# EAGLE board Index Registers - 1.1 (EAGLE 9.6.2), part 1 of 2
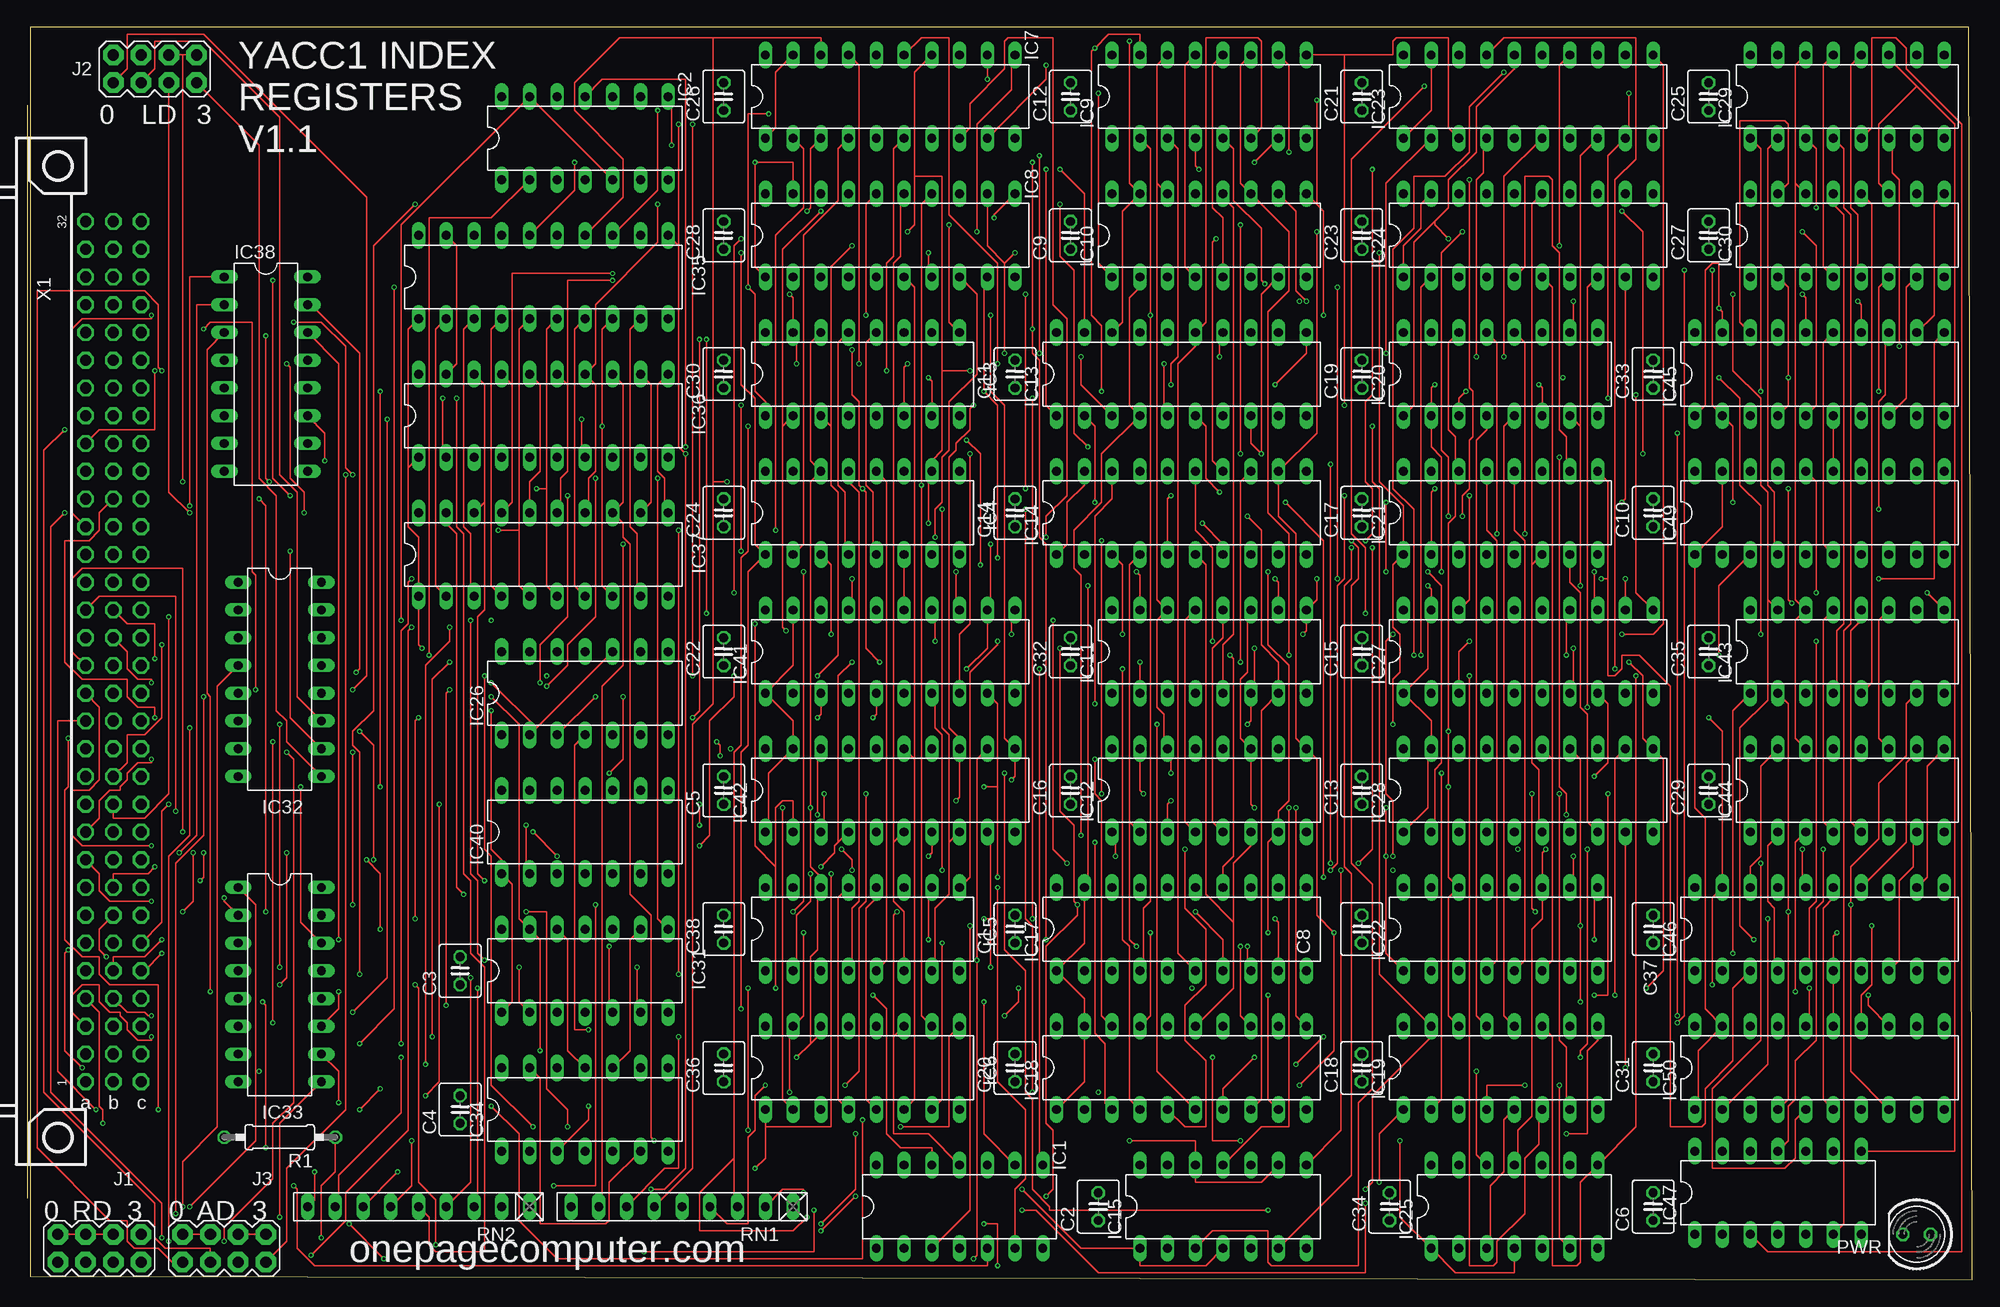
[diagram p8: board, top side]
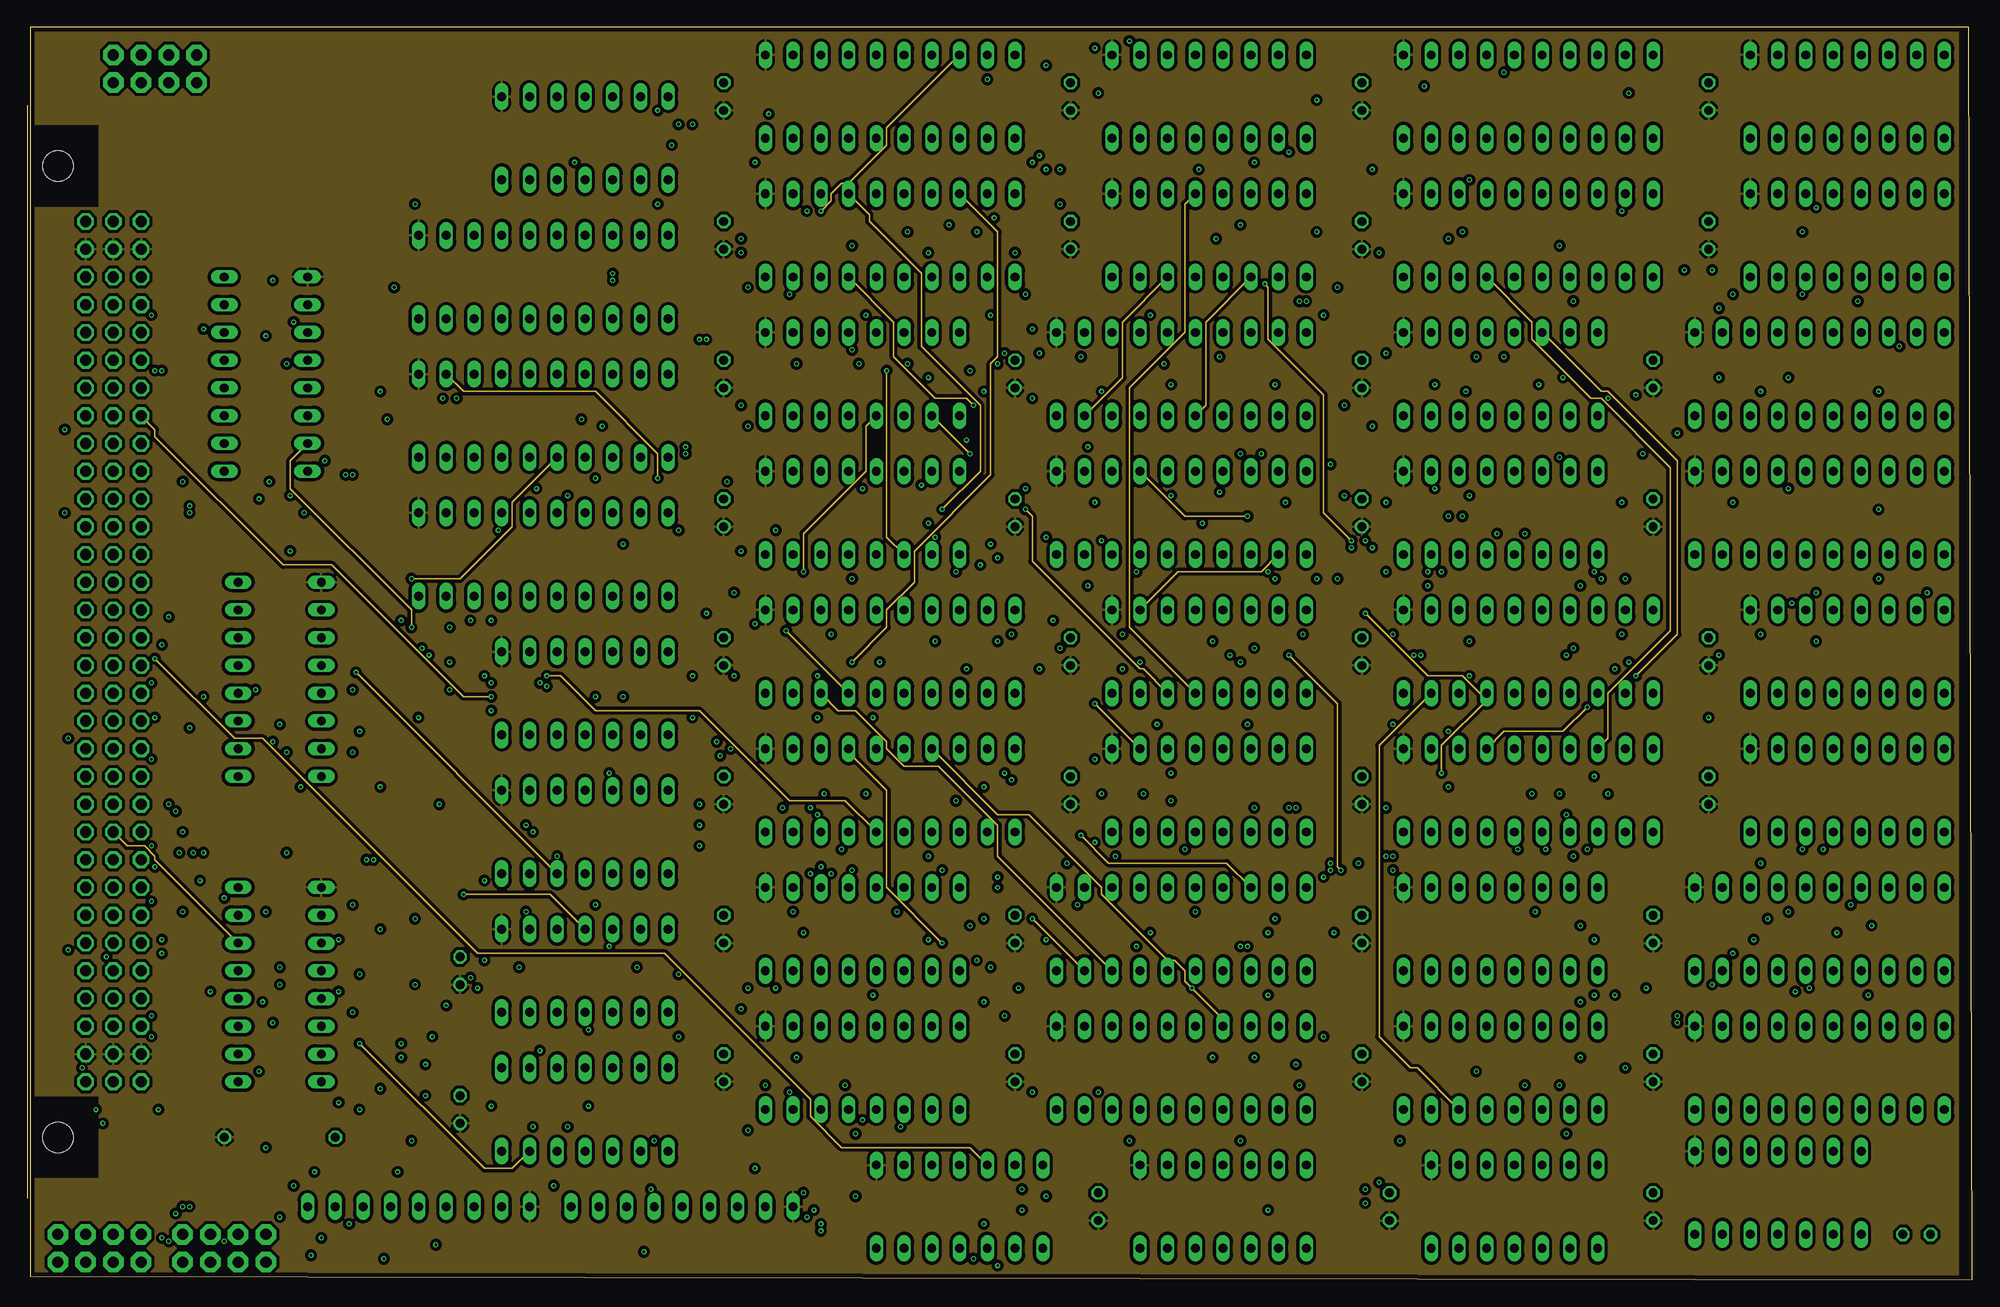
[diagram p9: board, inner layer Route2]
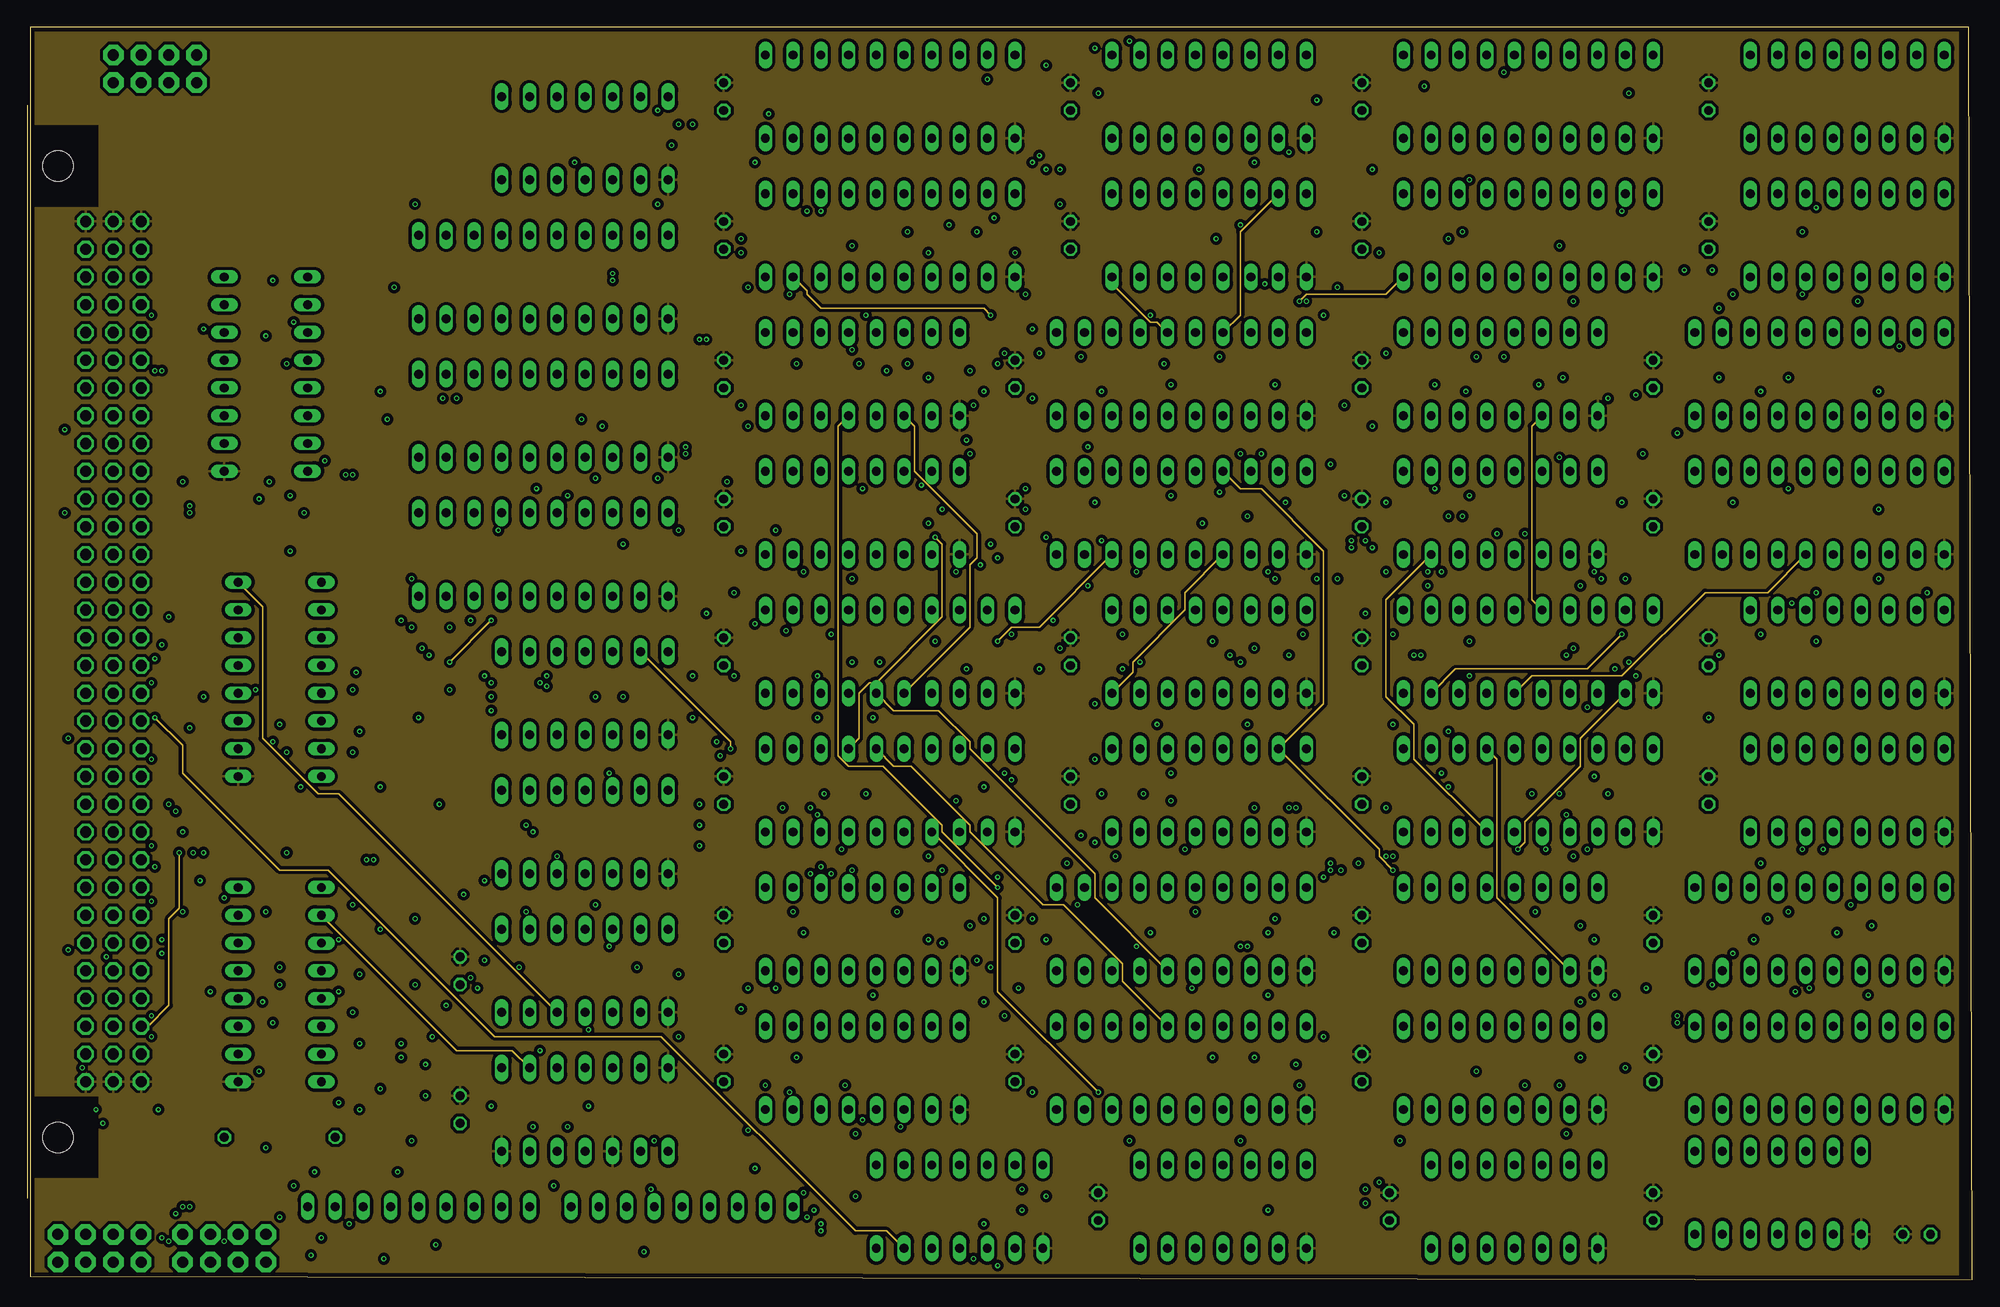
[diagram p10: board, inner layer Route15]
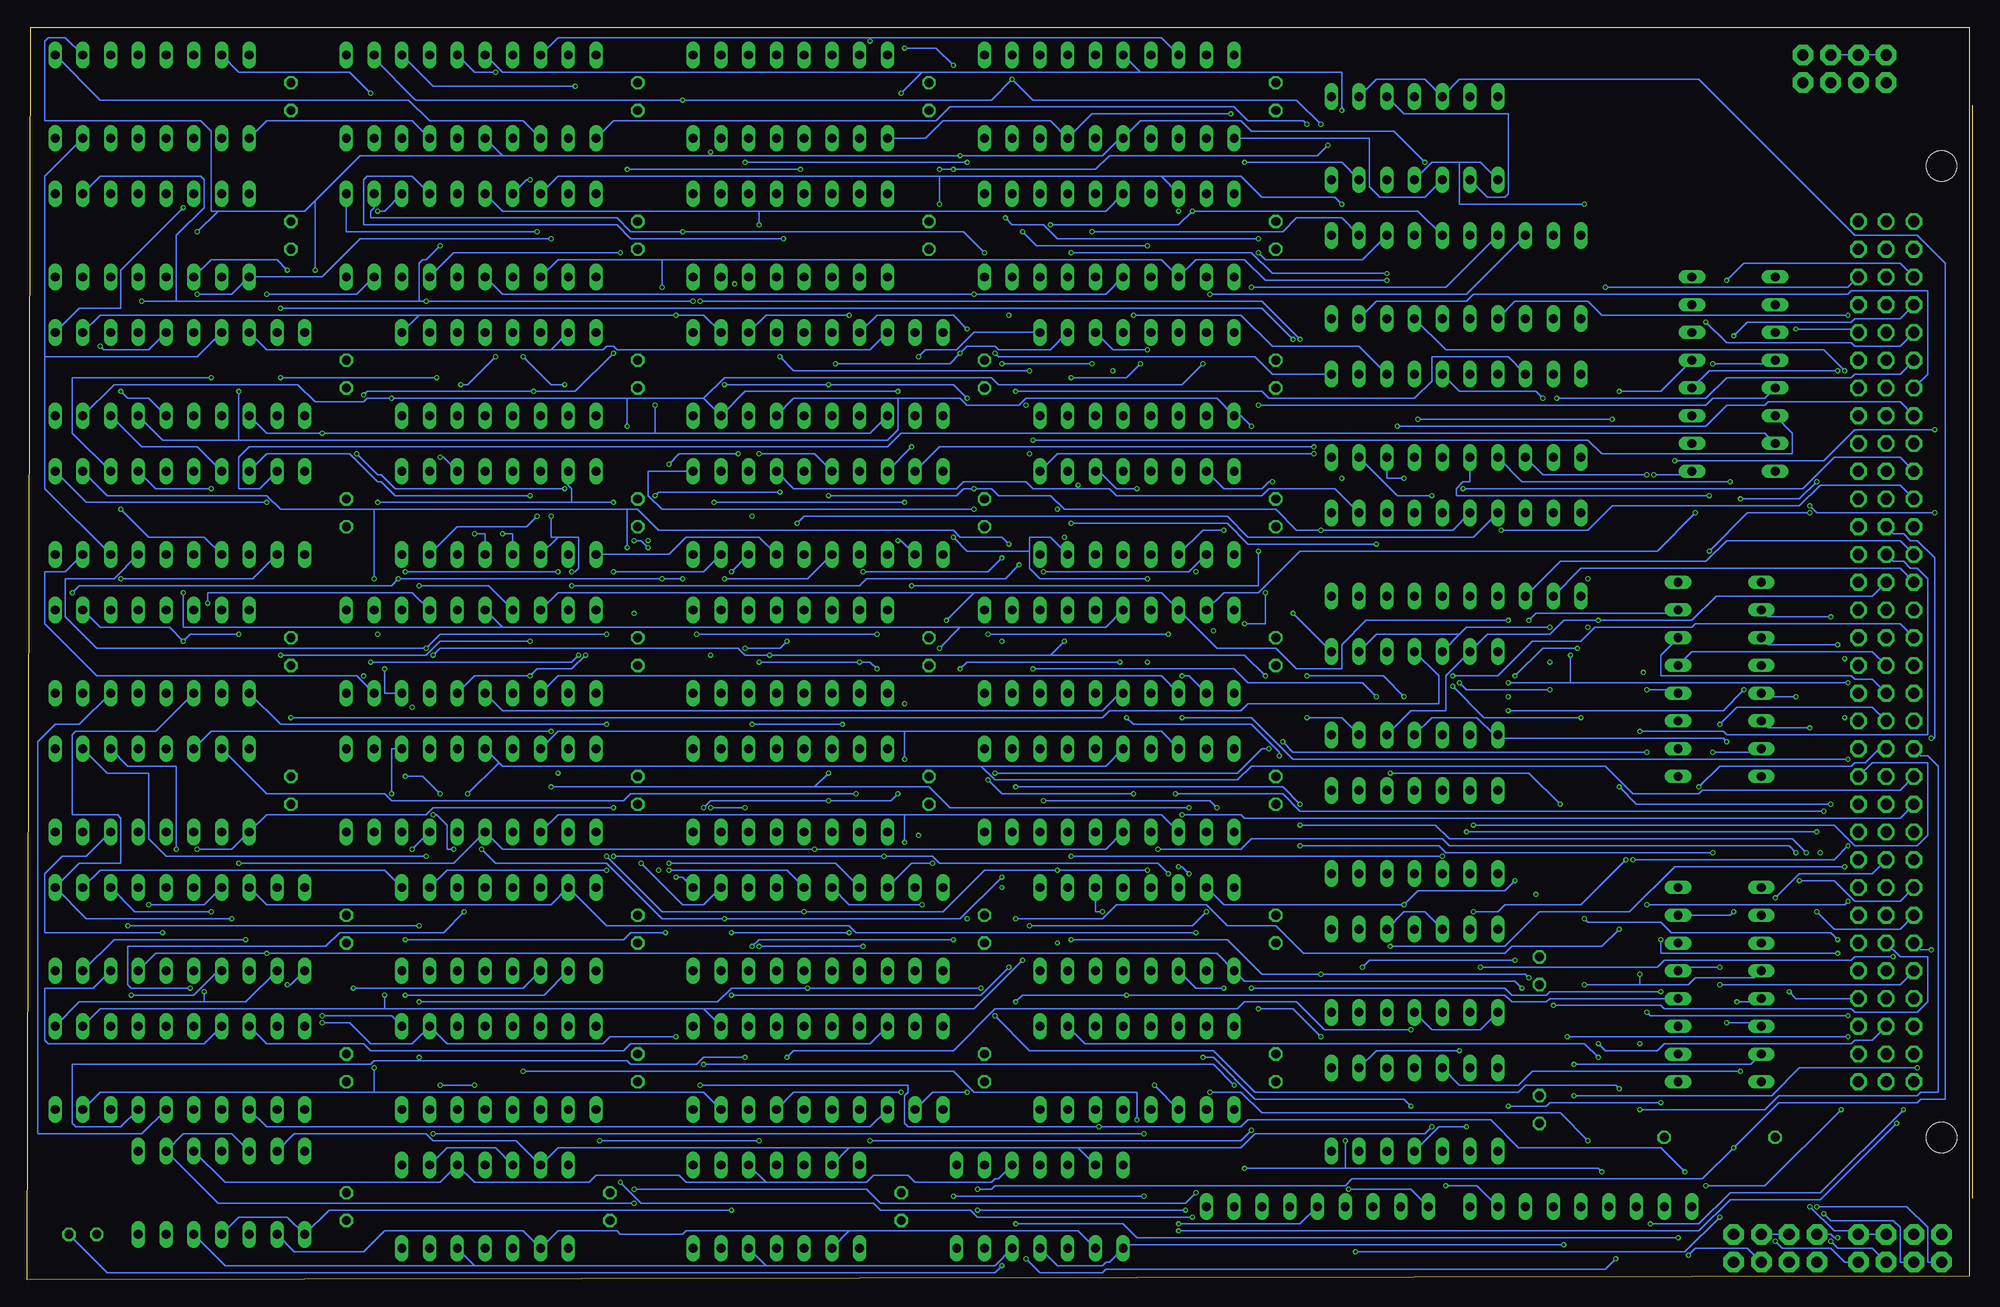
[diagram p11: board, bottom side, seen from below]

Size 177.8 x 114.62 mm. Coordinates in mm from the lower left corner, seen from the top.
Outline: 0,0.33 177.8,0 177.47,114.62 0,114.62 0,0.33
Copper layers (1*2*15*16): Top 0.035559375mm / dielectric 0.17018125mm / Route2 0.01778125mm / dielectric 47mil / Route15 0.01778125mm / dielectric 0.17018125mm / Bottom 0.035559375mm
Design rules "oshpark-4layer *": minimum track width 5mil, minimum drill 10mil, track to track 12mil, track to pad 10mil, pad to pad 5mil, via to via 5mil, smd to smd 5mil, copper to edge 15mil, drill to drill 6mil, minimum pad ring 4mil, minimum via ring 4mil, stop-mask expansion 2.5mil, vias tented up to drill 0mil, thermal gap 10mil

## Footprints (pad centres in the part's own frame; a part is rotated, then mirrored left to right if it is on the bottom)
C025-040X050 = drill 0.813 octagon: 1 -1.27,0; 2 1.27,0
DIL14 = drill 0.813 long: 1 -7.62,-3.81; 2 -5.08,-3.81; 3 -2.54,-3.81; 4 0,-3.81; 5 2.54,-3.81; 6 5.08,-3.81; 7 7.62,-3.81; 8 7.62,3.81; 9 5.08,3.81; 10 2.54,3.81; 11 0,3.81; 12 -2.54,3.81; 13 -5.08,3.81; 14 -7.62,3.81
DIL16 = drill 0.813 long: 1 -8.89,-3.81; 2 -6.35,-3.81; 3 -3.81,-3.81; 4 -1.27,-3.81; 5 1.27,-3.81; 6 3.81,-3.81; 7 6.35,-3.81; 8 8.89,-3.81; 9 8.89,3.81; 10 6.35,3.81; 11 3.81,3.81; 12 1.27,3.81; 13 -1.27,3.81; 14 -3.81,3.81; 15 -6.35,3.81; 16 -8.89,3.81
DIL20 = drill 0.813 long: 1 -11.43,-3.81; 2 -8.89,-3.81; 3 -6.35,-3.81; 4 -3.81,-3.81; 5 -1.27,-3.81; 6 1.27,-3.81; 7 3.81,-3.81; 8 6.35,-3.81; 9 8.89,-3.81; 10 11.43,-3.81; 11 11.43,3.81; 12 8.89,3.81; 13 6.35,3.81; 14 3.81,3.81; 15 1.27,3.81; 16 -1.27,3.81; 17 -3.81,3.81; 18 -6.35,3.81; 19 -8.89,3.81; 20 -11.43,3.81
2X4 = drill 1.016 pad 1.88 octagon: 1 -3.81,-1.27; 2 -3.81,1.27; 3 -1.27,-1.27; 4 -1.27,1.27; 5 1.27,-1.27; 6 1.27,1.27; 7 3.81,-1.27; 8 3.81,1.27
LED5MM = drill 0.813 octagon: A -1.27,0; K 1.27,0
0207/10 = drill 0.813 octagon: 1 -5.08,0; 2 5.08,0
RN-9 = drill 0.813 long: 1 -10.16,0; 2 -7.62,0; 3 -5.08,0; 4 -2.54,0; 5 0,0; 6 2.54,0; 7 5.08,0; 8 7.62,0; 9 10.16,0
FABC96R = drill 1.016 octagon: A1 -2.54,39.37; A2 -2.54,36.83; A3 -2.54,34.29; A4 -2.54,31.75; A5 -2.54,29.21; A6 -2.54,26.67; A7 -2.54,24.13; A8 -2.54,21.59; A9 -2.54,19.05; A10 -2.54,16.51; A11 -2.54,13.97; A12 -2.54,11.43; A13 -2.54,8.89; A14 -2.54,6.35; A15 -2.54,3.81; A16 -2.54,1.27; A17 -2.54,-1.27; A18 -2.54,-3.81; A19 -2.54,-6.35; A20 -2.54,-8.89; A21 -2.54,-11.43; A22 -2.54,-13.97; A23 -2.54,-16.51; A24 -2.54,-19.05; A25 -2.54,-21.59; A26 -2.54,-24.13; A27 -2.54,-26.67; A28 -2.54,-29.21; A29 -2.54,-31.75; A30 -2.54,-34.29; A31 -2.54,-36.83; A32 -2.54,-39.37; B1 -5.08,39.37; B2 -5.08,36.83; B3 -5.08,34.29; B4 -5.08,31.75; B5 -5.08,29.21; B6 -5.08,26.67; B7 -5.08,24.13; B8 -5.08,21.59; B9 -5.08,19.05; B10 -5.08,16.51; B11 -5.08,13.97; B12 -5.08,11.43; B13 -5.08,8.89; B14 -5.08,6.35; B15 -5.08,3.81; B16 -5.08,1.27; B17 -5.08,-1.27; B18 -5.08,-3.81; B19 -5.08,-6.35; B20 -5.08,-8.89; B21 -5.08,-11.43; B22 -5.08,-13.97; B23 -5.08,-16.51; B24 -5.08,-19.05; B25 -5.08,-21.59; B26 -5.08,-24.13; B27 -5.08,-26.67; B28 -5.08,-29.21; B29 -5.08,-31.75; B30 -5.08,-34.29; B31 -5.08,-36.83; B32 -5.08,-39.37; C1 -7.62,39.37; C2 -7.62,36.83; C3 -7.62,34.29; C4 -7.62,31.75; C5 -7.62,29.21; C6 -7.62,26.67; C7 -7.62,24.13; C8 -7.62,21.59; C9 -7.62,19.05; C10 -7.62,16.51; C11 -7.62,13.97; C12 -7.62,11.43; C13 -7.62,8.89; C14 -7.62,6.35; C15 -7.62,3.81; C16 -7.62,1.27; C17 -7.62,-1.27; C18 -7.62,-3.81; C19 -7.62,-6.35; C20 -7.62,-8.89; C21 -7.62,-11.43; C22 -7.62,-13.97; C23 -7.62,-16.51; C24 -7.62,-19.05; C25 -7.62,-21.59; C26 -7.62,-24.13; C27 -7.62,-26.67; C28 -7.62,-29.21; C29 -7.62,-31.75; C30 -7.62,-34.29; C31 -7.62,-36.83; C32 -7.62,-39.37 | hole 2.794: 0,-44.456; 0,44.456

## Placement (x,y rotation side)
C1  0.1  [C025-040X050]  90.17,32.08 90 top
C2  0.1  [C025-040X050]  97.79,6.68 90 top
C3  0.1  [C025-040X050]  39.37,28.27 90 top
C4  0.1  [C025-040X050]  39.37,15.57 90 top
C5  0.1  [C025-040X050]  63.5,44.78 90 top
C6  0.1  [C025-040X050]  148.59,6.68 90 top
C8  0.1  [C025-040X050]  121.92,32.08 90 top
C9  0.1  [C025-040X050]  95.25,95.58 90 top
C10  0.1  [C025-040X050]  148.59,70.18 90 top
C11  0.1  [C025-040X050]  90.17,82.88 90 top
C12  0.1  [C025-040X050]  95.25,108.28 90 top
C13  0.1  [C025-040X050]  121.92,44.78 90 top
C14  0.1  [C025-040X050]  90.17,70.18 90 top
C15  0.1  [C025-040X050]  121.92,57.48 90 top
C16  0.1  [C025-040X050]  95.25,44.78 90 top
C17  0.1  [C025-040X050]  121.92,70.18 90 top
C18  0.1  [C025-040X050]  121.92,19.38 90 top
C19  0.1  [C025-040X050]  121.92,82.88 90 top
C20  0.1  [C025-040X050]  90.17,19.38 90 top
C21  0.1  [C025-040X050]  121.92,108.28 90 top
C22  0.1  [C025-040X050]  63.5,57.48 90 top
C23  0.1  [C025-040X050]  121.92,95.58 90 top
C24  0.1  [C025-040X050]  63.5,70.18 90 top
C25  0.1  [C025-040X050]  153.67,108.28 90 top
C26  0.1  [C025-040X050]  63.5,108.28 90 top
C27  0.1  [C025-040X050]  153.67,95.58 90 top
C28  0.1  [C025-040X050]  63.5,95.58 90 top
C29  0.1  [C025-040X050]  153.67,44.78 90 top
C30  0.1  [C025-040X050]  63.5,82.88 90 top
C31  0.1  [C025-040X050]  148.59,19.38 90 top
C32  0.1  [C025-040X050]  95.25,57.48 90 top
C33  0.1  [C025-040X050]  148.59,82.88 90 top
C34  0.1  [C025-040X050]  124.46,6.68 90 top
C35  0.1  [C025-040X050]  153.67,57.48 90 top
C36  0.1  [C025-040X050]  63.5,19.38 90 top
C37  0.1  [C025-040X050]  148.59,32.08 90 top
C38  0.1  [C025-040X050]  63.5,32.08 90 top
IC1  74LS32N  [DIL14]  85.09,6.68 0 top
IC2  74LS32N  [DIL14]  50.8,104.47 0 top
IC3  74LS192N  [DIL16]  76.2,82.88 0 top
IC4  74LS192N  [DIL16]  76.2,70.18 0 top
IC5  74LS192N  [DIL16]  76.2,32.08 0 top
IC6  74LS192N  [DIL16]  76.2,19.38 0 top
IC7  74LS244N  [DIL20]  78.74,108.28 0 top
IC8  74LS244N  [DIL20]  78.74,95.58 0 top
IC9  74LS192N  [DIL16]  107.95,108.28 0 top
IC10  74LS192N  [DIL16]  107.95,95.58 0 top
IC11  74LS192N  [DIL16]  107.95,57.48 0 top
IC12  74LS192N  [DIL16]  107.95,44.78 0 top
IC13  74LS244N  [DIL20]  105.41,82.88 0 top
IC14  74LS244N  [DIL20]  105.41,70.18 0 top
IC15  74LS32N  [DIL14]  109.22,6.68 0 top
IC17  74LS244N  [DIL20]  105.41,32.08 0 top
IC18  74LS244N  [DIL20]  105.41,19.38 0 top
IC19  74LS192N  [DIL16]  134.62,19.38 0 top
IC20  74LS192N  [DIL16]  134.62,82.88 0 top
IC21  74LS192N  [DIL16]  134.62,70.18 0 top
IC22  74LS192N  [DIL16]  134.62,32.08 0 top
IC23  74LS244N  [DIL20]  137.16,108.28 0 top
IC24  74LS244N  [DIL20]  137.16,95.58 0 top
IC25  74LS32N  [DIL14]  135.89,6.68 0 top
IC26  74LS32N  [DIL14]  50.8,53.67 0 top
IC27  74LS244N  [DIL20]  137.16,57.48 0 top
IC28  74LS244N  [DIL20]  137.16,44.78 0 top
IC29  74LS192N  [DIL16]  166.37,108.28 0 top
IC30  74LS192N  [DIL16]  166.37,95.58 0 top
IC31  74LS32N  [DIL14]  50.8,28.27 0 top
IC32  74LS139N  [DIL16]  22.86,54.94 270 top
IC33  74LS139N  [DIL16]  22.86,27 270 top
IC34  4077N  [DIL14]  50.8,15.57 0 top
IC35  74LS245N  [DIL20]  46.99,91.77 0 top
IC36  74LS245N  [DIL20]  46.99,79.07 0 top
IC37  74LS245N  [DIL20]  46.99,66.37 0 top
IC38  74LS139N  [DIL16]  21.59,82.88 270 top
IC40  74LS32N  [DIL14]  50.8,40.97 0 top
IC41  74LS244N  [DIL20]  78.74,57.48 0 top
IC42  74LS244N  [DIL20]  78.74,44.78 0 top
IC43  74LS192N  [DIL16]  166.37,57.48 0 top
IC44  74LS192N  [DIL16]  166.37,44.78 0 top
IC45  74LS244N  [DIL20]  163.83,82.88 0 top
IC46  74LS244N  [DIL20]  163.83,32.08 0 top
IC47  74LS32N  [DIL14]  160.02,7.95 0 top
IC49  74LS244N  [DIL20]  163.83,70.18 0 top
IC50  74LS244N  [DIL20]  163.83,19.38 0 top
J1  [2X4]  6.35,2.87 0 top
J2  [2X4]  11.43,110.82 0 top
J3  [2X4]  17.78,2.87 0 top
PWR  [LED5MM]  172.72,4.14 180 top
R1  330  [0207/10]  22.86,13.03 180 top
RN1  10k  [RN-9]  59.69,6.68 180 top
RN2  10k  [RN-9]  35.56,6.68 180 top
X1  FABC96R  [FABC96R]  2.54,57.48 180 top

## Tracks (layer width: path | path; a pad name or v marks a point on that pad's centre or on a via)
-ADDRSEL  (via drill 0.25)
  Top 0.127: J3.8 J3.6 | IC38.1 14.61,91.77 v14.61,70.81 | v3.17,70.18 1.91,68.91 1.91,17.16 12.06,7 v12.06,3.82 | J3.2 J3.4
  Bottom 0.127: v14.61,70.81 13.97,70.18 v3.17,70.18 | v12.06,3.82 12.38,3.82 12.7,4.14 J3.2 | J3.4 J3.6
-ARD0  (via drill 0.25)
  Top 0.127: v12.06,83.2 11.75,83.52 11.75,89.23 10.48,90.5 0.64,90.5 0.64,12.08 7.3,5.41 8.89,5.41 8.89,3.5 9.53,2.87 11.75,2.87 13.02,1.6 J3.1
  Bottom 0.127: IC38.12 23.81,83.2 v12.06,83.2
-BUS-EN  (via drill 0.25)
  Top 0.127: IC31.1 44.13,25.41 44.13,36.21 IC40.1 43.18,38.43 42.23,39.38 v42.23,52.08 | v15.88,87.01 16.51,87.64 20.32,87.64 20.32,64.78 20.64,64.47 v20.64,53.99
  Bottom 0.127: IC31.1 44.77,22.87 49.21,22.87 IC31.4 | X1.C28 10.48,87.01 v15.88,87.01 | v20.64,53.99 22.54,52.08 v42.23,52.08
-HL-SWAP  (via drill 0.25)
  Top 0.127: v46.67,20.97 46.67,31.13 IC31.13 44.77,33.03 44.77,50.81 v42.23,53.35
  Route2 0.127: X1.C25 11.43,77.8 11.43,77.16 23.18,65.42 27.62,65.42 39.69,53.35 v42.23,53.35
  Bottom 0.127: IC34.9 54.29,20.97 v46.67,20.97
-LDSEL  (via drill 0.25)
  Top 0.127: J2.8 13.97,112.09 | 13.97,112.09 J2.6 | IC34.6 53.02,8.9 53.02,5.41 52.7,5.09 46.67,5.09 46.67,18.43 IC34.13 | v13.97,73.04 13.97,112.09 | v20.95,71.45 21.59,70.81 v21.59,33.67
  Route15 0.127: IC33.15 39.05,20.97 44.13,20.97 IC34.13
  Bottom 0.127: J2.2 J2.4 J2.6 | v13.97,73.04 15.56,71.45 v20.95,71.45 | v21.59,33.67 21.91,33.35 IC33.15
-R0-ADDRSEL  (via drill 0.25)
  Top 0.127: IC42.1 67.63,41.29 67.63,46.37 IC42.19 69.85,51.13 IC41.1 69.85,56.21 IC41.19 | v23.5,83.83 23.81,83.52 23.81,73.36 25.08,72.08 v25.08,70.18
  Bottom 0.127: IC38.4 18.1,83.83 v23.5,83.83 | v25.08,70.18 28.57,66.69 61.28,66.69 65.09,62.88 68.26,62.88 IC41.19
-R0-LDSEL  (via drill 0.25)
  Top 0.127: v77.15,26.05 78.42,24.78 78.42,13.35 79.69,12.08 82.55,12.08 IC1.12 | IC1.9 87.31,13.35 v87.31,25.41
  Bottom 0.127: IC33.12 38.42,25.73 38.73,25.41 41.91,25.41 42.55,26.05 v77.15,26.05 86.68,26.05 v87.31,25.41
-R0-RDSEL  (via drill 0.25)
  Top 0.127: v35.24,27 35.56,26.68 35.56,8.9 37.15,7.32 v37.15,3.19 | v35.24,98.44 31.43,94.63 31.43,52.08 29.53,50.18 29.53,48.91 30.16,48.27 v30.16,27.95
  Bottom 0.127: IC2.1 44.77,102.25 46.67,102.25 | 46.67,102.25 49.21,102.25 IC2.4 | IC1.4 83.5,1.28 79.38,1.28 79.06,1.6 78.74,1.6 IC1.1 77.15,3.19 v37.15,3.19 | IC33.4 19.68,27.63 25.08,27.63 25.72,27 30.16,27 | v35.24,27 30.16,27 | 46.67,102.25 46.67,98.44 v35.24,98.44 | 30.16,27 v30.16,27.95
-R1-ADDRSEL  (via drill 0.25)
  Top 0.127: IC18.1 96.52,18.11 IC18.19 96.52,25.73 IC17.1 96.52,30.81 IC17.19 96.84,36.21 v96.84,63.51 | v65.09,66.69 v65.09,80.02
  Bottom 0.127: IC38.5 18.73,80.66 23.5,80.66 24.13,80.02 v65.09,80.02 | v65.09,66.69 65.09,63.51 v96.84,63.51
-R1-LDSEL  (via drill 0.25)
  Top 0.127: IC33.11 28.26,24.78 v28.26,26.36 | v65.72,13.67 v65.72,26.68 | v100.65,12.71 106.68,12.71 IC15.12 106.68,8.9 112.71,8.9 IC15.9
  Bottom 0.127: v28.26,26.36 38.42,26.36 38.73,26.05 41.91,26.05 42.55,26.68 v65.72,26.68 | v65.72,13.67 66.67,12.71 v100.65,12.71
-R1-RDSEL  (via drill 0.25)
  Top 0.127: v21.27,25.41 21.59,25.09 v21.59,12.08 | v90.81,8.27 96.2,2.87 IC15.1 101.6,1.28 107.63,1.28 IC15.4
  Bottom 0.127: IC2.9 54.29,109.87 49.85,109.87 IC2.12 46.67,109.87 24.77,109.87 10.48,95.58 4.76,95.58 2.22,93.04 2.22,16.52 4.45,16.52 4.76,16.2 17.46,16.2 v21.59,12.08 24.45,9.22 56.52,9.22 57.15,8.59 89.22,8.59 89.53,8.27 v90.81,8.27 | IC33.5 19.37,25.41 v21.27,25.41
-R2-ADDRSEL  (via drill 0.25)
  Top 0.127: IC28.1 127.95,43.19 127.95,48.27 IC28.19 128.27,51.13 IC27.1 127.95,55.89 127.95,60.97 IC27.19 128.27,63.2 v127.95,63.51 | v85.72,76.85 87,75.58 v87,65.42
  Bottom 0.127: IC38.6 16.19,77.48 16.19,75.58 33.66,75.58 34.92,76.85 v85.72,76.85 | v87,65.42 88.27,64.15 100.97,64.15 101.6,63.51 v127.95,63.51
-R2-LDSEL  (via drill 0.25)
  Top 0.127: IC33.10 28.26,19.06 v28.26,16.2 | v42.23,15.89 44.77,13.35 44.77,5.41 48.26,1.92 76.2,1.92 v76.2,14.62 | v132.4,19.06 132.4,11.44 IC25.12
  Bottom 0.127: IC25.12 134.94,12.08 139.38,12.08 IC25.9 | v28.26,16.2 38.42,16.2 38.73,15.89 v42.23,15.89 | v76.2,14.62 76.2,17.16 91.12,17.16 93.03,19.06 v132.4,19.06
-R2-RDSEL  (via drill 0.25)
  Top 0.127: IC25.4 135.89,0.65 130.49,0.65 IC25.1 125.41,5.73 v125.41,12.71 | v22.23,49.23 v22.23,23.51 | v110.81,12.71 108.27,12.71 v108.27,20.33 | v51.12,22.87 49.85,22.87 49.85,48.91 IC26.4
  Bottom 0.127: IC33.6 19.37,23.51 v22.23,23.51 | v22.23,49.23 22.54,49.54 42.86,49.54 IC26.1 43.5,49.86 45.09,51.45 49.21,51.45 IC26.4 | v110.81,12.71 v125.41,12.71 | v108.27,20.33 107.63,20.97 93.03,20.97 89.22,24.78 66.99,24.78 66.36,25.41 61.59,25.41 59.05,22.87 v51.12,22.87
-R3-ADDRSEL
  Top 0.127: IC50.1 152.72,15.89 152.72,20.97 IC50.19 153.35,24.78 153.35,42.24 152.4,43.19 IC49.1 154.94,68.91 IC49.19
  Bottom 0.127: IC38.7 18.73,77.48 97.79,77.48 99.06,76.21 157.48,76.21 158.43,75.26 158.43,72.4 156.53,72.4 IC49.19
-R3-LDSEL  (via drill 0.25)
  Top 0.127: IC33.9 22.86,14.3 v22.86,5.73 | v56.2,2.55 71.75,2.55 v71.75,6.36 | v90.81,6.36 92.08,6.36 97.79,0.65 122.24,0.65 v122.24,7
  Bottom 0.127: IC47.12 159.07,13.35 163.51,13.35 IC47.9 160.34,7 v122.24,7 | v22.86,5.73 26.04,2.55 v56.2,2.55 | v90.81,6.36 v71.75,6.36
-R3-RDSEL  (via drill 0.25)
  Top 0.127: v36.2,19.7 36.2,56.21 38.42,58.43 v38.42,59.7 | v113.35,6.36 93.34,6.36 93.34,6.68 91.76,8.27 91.76,16.52 91.12,17.16 91.12,28.27 89.22,30.17 v89.22,46.37
  Route15 0.127: v64.14,48.59 64.14,49.23 IC26.9
  Bottom 0.127: IC47.4 158.43,5.73 153.99,5.73 IC47.1 150.18,6.36 v113.35,6.36 | IC33.7 20,19.7 v36.2,19.7 | v38.42,59.7 46.04,59.7 46.67,59.07 | IC26.12 46.67,59.07 | IC26.9 54.29,59.07 46.67,59.07 | v89.22,46.37 66.99,46.37 64.77,48.59 v64.14,48.59
-RDSEL  (via drill 0.25)
  Top 0.127: J1.2 J1.4 J1.6 | IC33.1 20.64,34.3 20.64,19.06 | 20.64,19.06 20.64,12.71 v14.61,6.68 | 20.64,19.06 v20.95,19.06
  Bottom 0.127: v14.61,6.68 12.38,4.46 10.48,4.46 J1.8 J1.6 | IC34.12 46.67,17.79 41.27,17.79 40.01,19.06 v20.95,19.06
-REG-DN  (via drill 0.25)
  Top 0.127: v3.49,49.54 3.49,45.1 3.17,44.78 3.17,31.13 4.76,29.54 6.35,29.54 6.35,27.95 7.3,27 11.75,27 v11.75,15.57 | v24.13,8.59 24.45,8.27 24.45,2.87 26.04,1.28 87.63,1.28 IC1.5
  Bottom 0.127: IC1.5 89.22,1.28 110.17,1.28 | IC15.5 110.17,1.28 | 136.84,1.28 IC25.5 | 110.17,1.28 136.84,1.28 | IC47.5 159.7,1.28 136.84,1.28 | X1.B21 6.99,68.27 6.03,68.27 5.4,67.64 4.76,67.64 3.17,66.05 3.17,49.54 v3.49,49.54 | v11.75,15.57 18.73,8.59 v24.13,8.59
-REG-FUNC-LD  (via drill 0.25)
  Top 0.127: IC31.5 53.02,24.78 v53.02,30.49 | v11.43,37.8 10.79,37.16 7.62,37.16 X1.B8
  Bottom 0.127: v53.02,30.49 42.55,30.49 39.37,33.67 31.11,33.67 26.99,37.8 v11.43,37.8
-REG-FUNC-RD  (via drill 0.25)
  Top 0.127: IC31.2 44.77,25.41 v44.77,28.59 | v6.99,29.54 6.35,30.17 6.35,32.08 X1.B7
  Bottom 0.127: v44.77,28.59 28.57,28.59 27.94,29.22 10.79,29.22 10.48,29.54 v6.99,29.54
-REG-LD-HI  (via drill 0.25)
  Top 0.127: v30.16,50.18 31.43,48.91 v31.43,38.43 | v45.4,33.67 47.31,33.67 47.31,17.47 49.21,15.57 v49.21,13.98
  Bottom 0.127: 81.6,12.08 IC1.13 | 102.55,12.08 81.6,12.08 | IC15.13 102.55,12.08 | 102.55,12.08 129.22,12.08 IC25.13 133.03,12.71 140.65,12.71 141.29,13.35 153.35,13.35 IC47.13 | X1.B20 6.99,65.73 6.03,65.73 5.4,65.1 4.76,65.1 3.81,64.15 3.81,49.86 22.23,49.86 22.54,50.18 v30.16,50.18 | v31.43,38.43 35.56,34.3 42.55,34.3 43.18,33.67 v45.4,33.67 | v49.21,13.98 49.85,13.35 65.41,13.35 66.67,12.08 81.6,12.08
-REG-LD-LO  (via drill 0.25)
  Top 0.127: X1.B18 8.89,60.02 11.43,60.02 v11.43,56.84
  Route2 0.127: v11.43,56.84 18.73,49.54 21.27,49.54 40.96,29.86 58.1,29.86 71.44,16.52 71.44,14.94 74.3,12.08 86.04,12.08 IC1.10
  Bottom 0.127: IC47.10 159.7,8.9 140.02,8.9 IC25.10 136.84,8.9 126.36,8.9 125.73,9.54 118.11,9.54 117.47,8.9 110.17,8.9 | IC1.10 88.9,9.22 89.22,9.22 89.53,8.9 96.52,8.9 97.16,9.54 100.33,9.54 100.97,8.9 110.17,8.9 | IC15.10 110.17,8.9
-REG-RD-HI  (via drill 0.25)
  Top 0.127: IC2.5 IC2.13 33.97,96.53 v33.97,60.34
  Bottom 0.127: IC26.5 51.12,52.08 47.94,52.08 47.94,55.26 IC26.13 44.13,59.07 38.42,59.07 37.15,60.34 v33.97,60.34 25.4,60.34 23.18,62.56 8.89,62.56 X1.B19
-REG-RD-LO  (via drill 0.25)
  Top 0.127: IC26.10 46.35,50.49 | 46.35,50.49 IC26.2 | X1.B17 8.89,57.48 8.89,55.89 9.84,54.94 11.11,54.94 v11.11,54.62 | 46.35,50.49 v42.23,54.62 | IC2.2 42.23,97.17 36.51,97.17 v36.51,57.16
  Bottom 0.127: IC2.2 44.13,99.07 42.55,99.07 42.23,99.39 42.23,106.69 51.75,106.69 IC2.10 | v42.23,54.62 36.51,54.62 | 36.51,54.62 v11.11,54.62 | 36.51,54.62 v36.51,57.16
-REG-UP  (via drill 0.25)
  Top 0.127: X1.B22 6.35,70.18 6.35,68.59 5.4,67.64 3.17,67.64 3.17,56.53 4.76,54.94 8.89,54.94 8.89,53.35 9.84,52.4 11.43,52.4 v11.43,51.45
  Route15 0.127: v11.43,51.45 13.97,48.91 13.97,46.37 22.86,37.48 27.3,37.48 42.55,22.24 57.78,22.24 75.56,4.46 78.42,4.46 IC1.2
  Bottom 0.127: IC47.2 153.35,2.55 147,2.55 145.1,4.46 132.4,4.46 IC25.2 129.22,4.46 123.83,4.46 123.51,4.14 117.79,4.14 117.47,4.46 102.55,4.46 | IC1.2 81.6,4.46 102.55,4.46 | IC15.2 102.55,4.46
-RESET  (via drill 0.25)
  Top 0.127: v30.16,21.6 33.34,24.78 v33.34,90.82
  Route2 0.127: IC34.2 44.13,10.17 41.59,10.17 v30.16,21.6
  Bottom 0.127: v33.34,90.82 11.11,90.82 X1.C30
-RLD0  (via drill 0.25)
  Top 0.127: v29.53,53.99 30.8,55.26 30.8,99.07 15.88,114 8.89,114 8.89,110.82 J2.1
  Bottom 0.127: IC32.12 26.99,53.99 v29.53,53.99
-RRD0  (via drill 0.25)
  Top 0.127: IC32.4 17.14,54.3 17.14,13.98 13.97,10.81 v13.97,6.68
  Bottom 0.127: v13.97,6.68 5.71,6.68 3.81,4.78 3.81,1.6 J1.1
-VMA  (via drill 0.25)
  Top 0.127: IC40.2 45.4,37.48 v45.4,41.6
  Bottom 0.127: v45.4,41.6 12.38,41.6 10.48,39.7 4.76,39.7 3.81,40.65 3.81,47.32 8.89,47.32 X1.C12
ADATA0  (via drill 0.25)
  Top 0.127: RN1.2 68.9,8.27 70.8,8.27 v70.8,7.95 | v122.24,8.27 122.87,8.9 122.87,16.84 128.27,22.24 IC19.15 123.51,27.95 123.51,72.4 122.87,73.04 v122.87,78.12 | v69.53,90.18 69.85,89.86 IC3.15 70.17,86.37 v70.17,83.83 | IC7.9 93.03,109.87 v93.03,111.14 | IC9.15 101.6,114 98.74,114 v97.47,112.72 97.16,112.41 97.16,88.28 98.11,87.33 v98.11,81.29 | v146.37,108.6 146.37,104.79 IC23.9 144.46,102.88 v144.46,80.66
  Bottom 0.127: v70.8,7.95 71.75,7 99.69,7 100.97,8.27 v122.24,8.27 | IC35.18 46.04,90.18 v69.53,90.18 | v93.03,111.14 94.61,112.72 v97.47,112.72 | v146.37,108.6 148.27,110.5 158.43,110.5 IC29.15 | 115.89,80.66 IC13.9 112.08,81.29 v98.11,81.29 | 122.87,80.66 v144.46,80.66 146.69,80.66 147,80.34 151.45,80.34 153.03,81.93 169.86,81.93 IC45.9 | 122.87,80.66 115.89,80.66 | v70.17,83.83 72.07,81.93 88.9,81.93 89.53,82.56 113.98,82.56 115.89,80.66 | 122.87,80.66 v122.87,78.12
ADATA1  (via drill 0.25)
  Top 0.127: RN1.3 64.45,7 64.45,11.12 | 64.45,11.12 64.45,48.27 65.09,48.91 65.09,66.05 65.72,66.69 v65.72,78.12 | IC19.1 123.51,13.35 v123.51,8.9 | v71.12,5.73 69.85,4.46 61.28,4.46 61.28,7.95 64.45,11.12 | IC3.1 67.31,80.34 66.36,81.29 66.36,90.18 v65.72,90.82 65.72,106.69 v67.63,106.69 | IC29.1 158.43,103.52 v158.43,81.29
  Bottom 0.127: IC23.7 142.56,106.06 155.89,106.06 IC29.1 | IC9.1 95.57,104.47 93.98,106.06 84.14,106.06 IC7.7 80.33,106.69 v67.63,106.69 | v65.72,78.12 66.67,79.07 IC3.1 68.9,80.66 86.36,80.66 87,80.02 91.76,80.02 92.39,80.66 98.11,80.66 | v123.51,8.9 121.6,7 100.33,7 99.69,6.36 91.44,6.36 90.81,5.73 v71.12,5.73 | IC13.7 107.63,80.66 98.11,80.66 | IC35.17 47.94,90.82 v65.72,90.82 | IC45.7 165.42,76.85 158.43,76.85 | 158.43,76.85 99.06,76.85 98.11,77.8 98.11,80.66 | 158.43,76.85 v158.43,81.29
ADATA2  (via drill 0.25)
  Top 0.127: RN1.4 63.82,5.09 65.72,5.09 65.72,13.03 66.36,13.67 66.36,16.84 v67.31,17.79 | v118.43,22.24 v115.89,19.7 | v103.82,83.83 103.82,79.39 IC13.5 | IC35.16 49.85,99.71 v49.85,102.25 | IC9.10 115.25,111.14 v115.25,103.2 | IC45.5 163.51,80.02 163.51,94.63 v162.24,95.9 | v92.39,102.88 v92.39,84.78 | v150.81,23.51 151.45,24.14 v151.45,92.41
  Bottom 0.127: v67.31,17.79 69.22,19.7 v115.89,19.7 | v118.43,22.24 124.46,22.24 125.09,21.6 139.38,21.6 IC19.10 142.56,21.6 146.37,21.6 148.27,23.51 v150.81,23.51 | IC3.10 84.14,85.1 88.9,85.1 89.22,85.42 91.76,85.42 v92.39,84.78 93.34,83.83 v103.82,83.83 | v49.85,102.25 52.7,105.11 65.72,105.11 66.67,106.06 75.88,106.06 IC7.5 77.79,104.47 79.38,102.88 v92.39,102.88 115.25,102.88 | 134.3,102.88 IC23.5 | 115.25,102.88 134.3,102.88 | 115.25,102.88 v115.25,103.2 | 160.34,97.8 v162.24,95.9 | 160.34,97.8 152.4,97.8 151.45,98.75 | 151.45,98.75 147.32,102.88 134.3,102.88 | IC29.10 174.31,113.68 175.9,113.68 176.21,113.36 176.21,106.06 161.93,106.06 160.97,105.11 160.97,97.8 160.34,97.8 | 151.45,98.75 v151.45,92.41
ADATA3  (via drill 0.25)
  Top 0.127: v72.39,5.09 75.56,8.27 v75.56,13.35 | v140.65,13.35 142.56,13.35 142.56,20.97 143.51,21.92 IC19.9 | 120.33,112.09 124.78,112.09 124.78,113.36 125.09,113.68 129.86,113.68 129.86,105.42 IC23.3 | 120.33,112.09 IC9.9 | v71.12,97.8 71.44,98.12 71.44,103.52 IC7.3 | IC13.3 96.2,81.93 v96.2,84.47 | v84.14,96.53 84.14,87.64 IC3.9 | v120.33,80.02 120.33,112.09 | v150.81,77.48 v150.81,24.14
  Bottom 0.127: RN1.5 61.28,5.09 v72.39,5.09 | v140.65,13.35 v75.56,13.35 | IC29.9 171.13,107.96 142.88,107.96 140.97,106.06 132.4,106.06 IC23.3 | IC35.15 50.48,97.8 v71.12,97.8 72.39,96.53 v84.14,96.53 | v96.2,84.47 95.57,85.1 92.71,85.1 91.12,86.69 IC3.9 | IC45.3 155.89,77.48 v150.81,77.48 120.33,77.48 | 120.33,77.48 100.65,77.48 IC13.3 | 120.33,77.48 v120.33,80.02 | IC19.9 144.46,24.14 v150.81,24.14
ADATA4  (via drill 0.25)
  Top 0.127: IC13.18 100.01,87.64 100.01,97.8 IC10.15 100.65,100.34 v100.65,113.36 | IC30.15 160.97,100.34 160.97,105.74 160.66,106.06 156.53,106.06 156.53,87.64 IC45.18 | IC35.14 54.29,99.07 54.29,102.56 49.85,107.01 49.85,109.55 53.98,113.68 62.55,113.68 | 62.55,113.68 72.39,113.68 IC7.18 | RN1.6 60.64,10.17 60.64,50.81 62.55,52.72 62.55,73.04 | 62.55,113.68 62.55,73.04 | 62.55,73.04 v63.82,73.04
  Bottom 0.127: 129.86,85.1 IC20.15 | 129.86,85.1 155.89,85.1 IC45.18 | IC13.18 100.65,85.1 123.83,85.1 124.14,85.42 124.78,85.42 125.09,85.1 129.86,85.1 | IC4.15 68.26,72.4 64.77,72.4 64.14,73.04 v63.82,73.04 | IC23.18 129.22,113.68 100.65,113.68 | 100.65,113.68 73.98,113.68 IC7.18 | 100.65,113.68 v100.65,113.36
ADATA5  (via drill 0.25)
  Top 0.127: RN1.7 58.1,10.17 59.37,10.17 v59.37,22.24 | v65.09,24.78 65.09,48.27 65.72,48.91 65.72,64.78 IC4.1 66.36,67.32 66.36,80.66 65.09,81.93 v65.09,93.99 | v162.24,90.18 162.56,89.86 IC45.16 | IC20.1 126.68,80.02 126.68,94.94 128.59,96.85 | 128.59,96.85 129.86,98.12 129.86,100.66 132.4,103.2 132.4,107.33 135.89,110.82 IC23.16 | v129.86,95.26 128.59,96.53 128.59,96.85 | IC35.13 57.47,99.71 v57.47,107.01 | IC10.1 97.79,93.04 v97.79,108.6
  Route15 0.127: IC13.16 103.19,87.64 102.55,87.64 99.06,91.14 IC10.1
  Bottom 0.127: v59.37,22.24 61.91,24.78 v65.09,24.78 | v162.24,90.18 159.07,90.18 IC30.1 150.81,91.77 147.32,95.26 v129.86,95.26 | v57.47,107.01 57.47,110.5 75.88,110.5 | IC7.16 75.88,110.5 | 95.89,110.5 v97.79,108.6 | 75.88,110.5 95.89,110.5 | IC23.16 134.3,110.5 95.89,110.5 | v65.09,93.99 64.45,93.36 55.56,93.36 IC35.13
ADATA6  (via drill 0.25)
  Top 0.127: IC20.10 141.29,87.01 v141.29,89.55 | v167.32,89.55 167.64,89.23 IC45.14 | IC23.14 140.02,111.14 v140.02,94.63 | IC10.10 115.89,97.8 115.89,90.5 v116.84,89.55 | v80.33,95.9 80.96,96.53 80.96,100.98 | 80.96,100.98 80.96,110.5 IC7.14 | RN1.8 52.39,7 52.39,54.3 54.29,56.21 v54.29,67.32 | v82.23,69.23 82.23,73.67 IC4.10 82.55,74.94 83.5,75.89 83.5,83.2 | 80.96,100.98 83.5,100.98 83.5,83.2 | IC13.14 108.9,86.37 v108.9,84.47 | 83.5,83.2 v86.04,83.2
  Route15 0.127: IC13.14 110.81,88.28 110.81,95.9 IC10.10
  Bottom 0.127: v167.32,89.55 164.15,89.55 | 164.15,89.55 141.92,89.55 | 141.92,89.55 v141.29,89.55 v116.84,89.55 | IC30.10 171.13,100.98 161.93,100.98 161.61,100.66 161.61,98.12 164.15,95.58 164.15,89.55 | v140.02,94.63 141.29,93.36 141.6,93.36 141.92,93.04 141.92,89.55 | IC35.12 57.47,97.17 61.59,97.17 62.87,95.9 v80.33,95.9 | v54.29,67.32 66.04,67.32 67.94,69.23 v82.23,69.23 | v108.9,84.47 107.63,83.2 v86.04,83.2
ADATA7  (via drill 0.25)
  Top 0.127: v87.63,109.87 IC7.12 | IC45.12 174.31,88.28 174.31,98.44 IC30.9 | 117.79,98.44 118.43,97.8 v118.43,88.28 | 117.79,98.44 IC10.9 | 117.79,98.44 v117.79,107.96 | v56.83,8.27 58.1,8.27 60.01,10.17 v60.01,75.58 59.37,76.21 59.37,94.63 | IC35.11 59.37,94.63 | 59.37,94.63 v59.37,105.74
  Bottom 0.127: IC23.12 146.05,111.77 142.24,107.96 v117.79,107.96 89.53,107.96 v87.63,109.87 85.72,107.96 61.59,107.96 v59.37,105.74 | IC13.12 115.89,88.28 v118.43,88.28 141.92,88.28 | IC20.9 141.92,88.28 | IC45.12 171.13,88.28 141.92,88.28 | RN1.9 51.12,8.27 v56.83,8.27 | IC4.9 83.5,75.58 v60.01,75.58
ADATA8  (via drill 0.25)
  Top 0.127: v47.94,8.59 51.75,8.59 v51.75,34.3 | 41.59,71.13 IC37.18 | 41.59,71.13 41.59,81.93 IC36.18 | IC8.9 87.31,91.45 v87.31,81.29 88.58,80.02 v88.58,66.05 | v41.59,36.52 40.96,37.16 40.96,60.66 41.59,61.29 41.59,71.13 | v145.73,71.13 146.05,71.45 IC24.9 | 159.07,62.24 IC43.15 | 159.07,62.24 159.07,72.08 158.43,72.72 158.43,80.66 155.89,83.2 v155.89,90.18 | v157.8,31.13 156.53,32.4 156.53,50.49 159.07,53.03 159.07,62.24 | v124.14,71.13 v124.14,64.78 | v101.28,64.78 101.6,64.47 IC11.15
  Route2 0.127: IC11.15 105.09,64.78 112.71,64.78 IC14.9
  Bottom 0.127: RN2.2 45.09,8.59 v47.94,8.59 | IC5.15 68.26,34.3 v51.75,34.3 50.48,35.57 42.55,35.57 v41.59,36.52 | v87.31,81.29 64.77,81.29 64.14,80.66 50.8,80.66 49.21,82.25 49.21,84.47 42.23,84.47 IC36.18 | IC21.15 128.27,72.72 127.95,72.4 127.95,71.13 | v145.73,71.13 127.95,71.13 | v155.89,90.18 147.64,90.18 IC24.9 | IC46.9 169.86,31.13 v157.8,31.13 | IC14.9 115.89,64.78 v124.14,64.78 | 127.95,71.13 v124.14,71.13 | v88.58,66.05 89.85,64.78 v101.28,64.78
ADATA9  (via drill 0.25)
  Top 0.127: IC37.17 44.13,71.13 44.13,81.93 | IC36.17 44.13,81.93 | IC8.7 82.23,92.09 v82.23,93.99 | v53.34,92.09 44.13,92.09 44.13,81.93 | v123.51,93.99 123.51,73.04 125.73,70.81 IC21.1 124.78,65.42 124.78,59.7 125.41,59.07 125.41,55.57 124.78,54.94 v124.78,50.81 | v107.31,69.23 109.22,67.32 IC14.7 | IC43.1 155.89,52.08 v155.89,29.86 | RN2.3 40.96,7 v40.96,26.68
  Route15 0.127: IC11.1 100.97,55.57 100.97,56.53 105.73,61.29 105.73,62.88 IC14.7
  Bottom 0.127: v82.23,93.99 65.72,93.99 63.82,92.09 v53.34,92.09 | IC21.1 119.06,66.37 117.47,67.96 110.81,67.96 IC14.7 | IC24.7 138.75,93.99 v123.51,93.99 | IC37.17 45.4,67.96 66.04,67.96 67.94,69.86 106.68,69.86 v107.31,69.23 | IC46.7 166.05,29.86 v155.89,29.86 68.9,29.86 IC5.1 66.36,27.32 41.59,27.32 v40.96,26.68 | v124.78,50.81 154.62,50.81 IC43.1
ADATA10  (via drill 0.25)
  Top 0.127: RN2.4 40.32,8.9 v40.32,27.63 | v82.23,31.13 82.23,35.57 IC5.10 | IC37.16 45.72,73.04 46.67,73.99 46.67,81.93 IC36.16 | v113.98,64.15 114.3,63.83 IC11.10 | v104.46,71.77 104.14,71.45 IC14.5 | v59.37,68.59 v59.37,27.95 | IC46.5 162.88,28.59 162.88,33.98 163.51,34.62 v163.51,58.43 | IC21.10 140.65,74.31 140.65,77.16 140.02,77.8 140.02,82.56 | 140.02,82.56 140.02,93.99 139.38,94.63 139.38,100.66 139.06,100.98 136.84,100.98 136.84,92.72 IC24.5 | v158.43,59.07 158.43,70.81 156.53,72.72 156.53,80.66 v154.62,82.56 | 140.02,82.56 v140.34,82.56 | v91.12,90.18 v91.12,72.4
  Bottom 0.127: v40.32,27.63 40.64,27.95 v59.37,27.95 64.77,27.95 67.94,31.13 v82.23,31.13 | IC14.5 106.36,64.15 v113.98,64.15 | IC37.16 47.31,68.59 v59.37,68.59 61.59,68.59 63.5,70.5 82.87,70.5 84.14,71.77 88.9,71.77 89.53,72.4 v91.12,72.4 92.08,72.4 92.71,71.77 v104.46,71.77 | IC43.10 171.13,59.7 164.78,59.7 v163.51,58.43 162.88,59.07 v158.43,59.07 | IC8.5 79.06,90.18 v91.12,90.18 134.3,90.18 IC24.5 | v140.34,82.56 v154.62,82.56
ADATA11  (via drill 0.25)
  Top 0.127: IC5.9 86.04,36.84 86.04,55.57 88.58,58.11 v88.58,58.43 | IC46.3 155.89,26.68 155.89,20.01 153.35,17.47 153.35,14.3 153.03,13.98 150.18,13.98 150.18,54.3 147.32,57.16 145.73,57.16 145.73,55.89 145.1,55.26 144.46,55.26 144.46,64.15 | 144.46,64.15 144.46,73.04 IC21.9 | v117.79,64.15 117.79,62.24 IC11.9 116.84,59.38 v116.52,59.07 | 144.46,64.15 v143.83,64.15 | v173.67,62.88 IC43.9 | IC14.3 100.01,65.42 v100.01,59.07 | RN2.5 36.51,5.73 36.51,3.19 37.15,2.55 41.59,2.55 41.59,28.59 40.32,29.86 40.32,36.52 39.69,37.16 39.69,68.27 39.05,68.91 v39.05,80.66 | IC37.15 48.58,70.5 48.58,73.36 49.21,73.99 49.21,81.93 | IC36.15 49.21,81.93 | v53.34,91.45 49.21,91.45 49.21,81.93 | v119.7,90.82 v119.7,64.15
  Route15 0.127: v88.58,58.43 89.85,59.7 92.39,59.7 IC14.3
  Bottom 0.127: v117.79,64.15 v119.7,64.15 v143.83,64.15 144.46,63.51 173.04,63.51 v173.67,62.88 | v116.52,59.07 v100.01,59.07 | 119.7,93.36 129.22,93.36 IC24.3 | 119.7,93.36 73.98,93.36 IC8.3 70.8,93.36 66.36,93.36 64.45,91.45 v53.34,91.45 | v39.05,80.66 39.69,81.29 46.67,81.29 IC36.15 | 119.7,93.36 v119.7,90.82
ADATA12  (via drill 0.25)
  Top 0.127: RN2.6 34.92,8.59 v34.92,12.71 | v69.53,17.16 69.53,22.87 IC6.15 70.8,24.14 v70.8,31.76 | IC44.15 158.43,47 158.43,38.75 157.48,37.8 IC46.18 | v97.47,52.72 97.47,69.86 99.06,71.45 IC14.18 | IC37.14 51.12,70.5 51.12,73.36 51.75,73.99 51.75,81.93 IC36.14 51.75,83.83 51.75,89.23 57.47,94.94 v57.47,98.44 | v96.84,76.21 95.57,77.48 95.57,92.41 94.3,93.67 v94.3,98.44 | v101.92,44.46 101.6,44.78 IC12.15
  Route2 0.127: v97.47,52.72 IC12.15
  Bottom 0.127: v34.92,12.71 37.47,15.25 64.77,15.25 66.67,17.16 v69.53,17.16 | IC46.18 155.89,34.3 129.86,34.3 IC22.15 124.78,32.4 102.55,32.4 101.92,31.76 v70.8,31.76 | 73.98,100.98 IC8.18 | 94.3,100.98 129.22,100.98 IC24.18 | 94.3,100.98 73.98,100.98 | v57.47,98.44 58.1,99.07 64.77,99.07 66.67,100.98 73.98,100.98 | v96.84,76.21 IC14.18 | 94.3,100.98 v94.3,98.44 | IC44.15 155.89,44.46 145.1,44.46 144.46,43.83 123.19,43.83 122.56,44.46 v101.92,44.46
ADATA13  (via drill 0.25)
  Top 0.127: IC36.13 54.29,81.93 54.29,71.13 IC37.13 54.29,69.23 54.29,67.96 54.93,67.32 54.93,35.25 56.83,33.35 56.83,13.03 v57.15,12.71 | v110.81,96.53 v110.81,75.58 | v76.52,88.28 76.52,98.44 IC8.16 | v33.66,9.86 RN2.7 | v66.36,10.17 67.31,11.12 67.31,13.98 | IC6.1 67.31,13.98 | IC46.16 162.24,36.21 v162.24,39.38 | IC12.1 99.38,40.65 v99.38,38.75 | IC22.1 124.14,29.86 v124.14,38.75 v124.14,43.19 | 67.31,13.98 73.34,13.98 v73.34,37.16
  Bottom 0.127: IC8.16 79.06,97.8 110.81,97.8 | 110.81,97.8 134.3,97.8 IC24.16 | IC14.16 105.73,75.58 v110.81,75.58 | 110.81,97.8 v110.81,96.53 | IC36.13 55.88,85.42 63.82,85.42 66.67,88.28 v76.52,88.28 | v33.66,9.86 33.97,10.17 57.15,10.17 | v66.36,10.17 57.15,10.17 | v162.24,39.38 159.07,39.38 IC44.1 155.89,42.56 141.29,42.56 140.65,43.19 v124.14,43.19 | v124.14,38.75 v99.38,38.75 94.93,38.75 94.3,38.11 74.3,38.11 v73.34,37.16 | 57.15,10.17 v57.15,12.71
ADATA14  (via drill 0.25)
  Top 0.127: IC22.10 141.29,36.21 v141.29,38.75 | IC46.14 171.77,40.02 171.77,47.32 172.72,48.27 IC44.10 | RN2.8 28.26,7 28.26,9.54 33.97,15.25 v33.97,20.33 | IC37.12 56.83,71.13 56.83,81.93 IC36.12 | IC8.14 81.6,98.44 v81.6,72.72 81.6,24.14 IC6.10 | v108.58,95.26 108.27,94.94 108.27,74.94 IC14.14
  Route15 0.127: v124.78,37.48 123.51,38.75 123.51,39.38 IC12.10 118.43,52.72 118.43,66.69 112.71,72.4 110.81,72.4 IC14.14
  Bottom 0.127: v141.29,38.75 165.1,38.75 166.69,40.34 166.69,46.37 170.5,46.37 IC44.10 | v124.78,37.48 139.38,37.48 IC22.10 | v33.97,20.33 35.24,21.6 80.96,21.6 IC6.10 | IC14.14 107.63,72.4 92.71,72.4 92.08,73.04 86.36,73.04 85.72,72.4 81.6,72.4 | 81.6,72.4 78.74,72.4 78.11,71.77 64.77,71.77 64.14,72.4 58.1,72.4 IC37.12 | 81.6,72.4 v81.6,72.72 | IC24.14 142.56,100.98 146.69,100.98 147,100.66 147,96.53 123.83,96.53 122.56,95.26 v108.58,95.26
ADATA15  (via drill 0.25)
  Top 0.127: RN2.9 26.04,7.32 v26.04,9.86 | v79.69,13.98 84.14,13.98 84.14,22.24 IC6.9 | IC37.11 58.1,70.5 58.1,73.36 57.47,73.99 57.47,81.93 IC36.11 | IC8.12 87.63,94.63 89.22,93.04 | v89.22,84.78 89.22,93.04 | IC44.9 173.67,47 173.67,36.84 IC46.12 | v117.79,95.9 117.79,77.48 IC14.12 114.3,69.86 115.89,68.27 115.89,49.54 IC12.9 117.79,47.64 117.79,33.35 v119.38,31.76 119.38,20.97 v116.2,17.79 | IC22.9 143.19,35.57 v143.19,31.13 | v90.17,93.99 89.22,93.04
  Bottom 0.127: v26.04,9.86 28.26,12.08 41.27,12.08 43.81,14.62 66.04,14.62 66.67,13.98 v79.69,13.98 97.16,13.98 97.47,14.3 97.47,16.84 97.16,17.16 97.16,17.79 v116.2,17.79 | v89.22,84.78 88.9,84.47 65.41,84.47 63.82,82.88 IC36.11 | IC22.9 145.1,37.48 171.13,37.48 IC46.12 | IC24.12 146.05,98.12 146.37,97.8 146.37,97.17 123.83,97.17 122.56,95.9 v117.79,95.9 92.08,95.9 v90.17,93.99 | v143.19,31.13 123.19,31.13 122.56,31.76 v119.38,31.76
ADDR0  (via drill 0.25)
  Top 0.127: v94.93,38.11 93.66,39.38 v93.66,60.34 | v131.76,71.77 131.76,62.24 IC27.18 | X1.A3 3.81,24.46 3.81,26.05 4.76,27 6.35,27 6.35,25.41 7.3,24.46 8.26,24.46 8.26,24.14 8.89,23.51 8.89,22.87 9.84,21.92 11.11,21.92 v11.11,22.24 | v36.83,22.24 36.83,54.94 v38.42,56.53
  Route15 0.127: v42.23,60.34 v38.42,56.53
  Bottom 0.127: IC17.18 96.84,38.11 v94.93,38.11 | 91.12,62.88 v93.66,60.34 | 91.12,62.88 73.98,62.88 IC41.18 68.9,57.8 63.5,57.8 61.59,55.89 57.47,55.89 57.47,58.11 55.24,60.34 v42.23,60.34 | IC27.18 129.22,62.88 91.12,62.88 | IC49.18 155.89,75.58 148.27,75.58 145.73,73.04 145.41,73.04 144.15,71.77 v131.76,71.77 | v36.83,22.24 v11.11,22.24
ADDR1  (via drill 0.25)
  Top 0.127: v94.3,57.8 94.3,42.88 95.57,41.6 95.57,34.62 v95.89,34.3 95.89,33.35 93.03,30.49 93.03,14.3 93.66,13.67 93.66,8.27 v93.03,7.63 | IC49.16 163.51,73.04 v163.51,62.88 | X1.A4 6.35,24.46 6.35,15.89 6.67,15.57 v6.67,14.3 | v75.56,7.63 v72.39,4.46
  Bottom 0.127: IC17.16 102.55,34.3 v95.89,34.3 | 92.39,59.7 v94.3,57.8 | 92.39,59.7 79.06,59.7 IC41.16 | 134.3,59.7 IC27.16 | 92.39,59.7 134.3,59.7 | v163.51,62.88 163.51,59.7 134.3,59.7 | v6.67,14.3 13.65,7.32 21.91,7.32 24.77,4.46 v72.39,4.46 | v93.03,7.63 v75.56,7.63
ADDR2  (via drill 0.25)
  Top 0.127: IC41.14 82.87,60.97 v82.87,58.43 | v109.86,57.16 110.17,56.84 110.17,38.75 109.22,37.8 IC17.14 | IC27.14 140.65,60.97 v140.65,57.16 | v160.97,72.4 160.97,62.24 v161.29,61.92 | v22.86,27 23.5,27.63 v23.5,39.06 | v61.28,39.7 62.23,40.65 62.23,51.13 64.45,53.35 v64.45,55.26
  Bottom 0.127: 84.14,57.16 v82.87,58.43 | 84.14,57.16 v109.86,57.16 112.08,57.16 112.71,57.8 140.02,57.8 v140.65,57.16 | IC49.14 166.05,72.4 v160.97,72.4 | v161.29,61.92 161.29,62.88 142.56,62.88 IC27.14 | X1.A5 6.35,27 v22.86,27 | v23.5,39.06 47.94,39.06 48.58,39.7 v61.28,39.7 | v64.45,55.26 66.36,57.16 84.14,57.16
ADDR3  (via drill 0.25)
  Top 0.127: v87.95,67.32 87.95,61.61 IC41.12 87.63,57.8 v85.72,55.89 | v121.6,38.11 122.87,39.38 v122.87,67 | v146.05,64.15 IC27.12 | v3.49,30.17 3.17,29.86 3.17,20.97 v4.76,19.38 | v36.2,16.84 37.47,18.11 v37.47,43.51 | v53.02,46.37 54.29,47.64 v54.29,53.35
  Bottom 0.127: v87.95,67.32 88.58,67.96 92.39,67.96 93.03,68.59 120.02,68.59 121.92,70.5 122.87,70.5 | 146.05,70.5 154.62,70.5 155.89,71.77 170.5,71.77 IC49.12 | 146.05,70.5 122.87,70.5 | IC17.12 115.89,34.3 117.79,34.3 v121.6,38.11 | 122.87,70.5 v122.87,67 | 146.05,70.5 v146.05,64.15 | X1.A6 4.45,30.17 v3.49,30.17 | v4.76,19.38 15.56,19.38 18.1,16.84 v36.2,16.84 | v37.47,43.51 40.32,46.37 v53.02,46.37 | v54.29,53.35 55.56,54.62 66.04,54.62 67.31,55.89 v85.72,55.89
ADDR4  (via drill 0.25)
  Top 0.127: IC41.9 88.58,52.72 88.58,45.1 | v88.58,36.84 88.58,45.1 | v113.98,33.03 114.3,32.71 IC17.9 | v13.97,33.67 14.92,34.62 v14.92,39.06 | v61.28,43.51 v61.28,41.6 | 88.58,45.1 v87.31,45.1
  Route15 0.127: IC27.9 141.92,49.54 141.92,47 136.84,41.92 136.84,40.02 v136.21,39.38
  Bottom 0.127: IC27.9 147.64,55.26 171.45,55.26 176.21,60.02 176.21,64.78 174.31,64.78 IC49.9 | v88.58,36.84 92.39,33.03 v113.98,33.03 119.7,33.03 124.78,38.11 134.94,38.11 v136.21,39.38 | X1.A7 6.35,32.08 12.38,32.08 v13.97,33.67 | v14.92,39.06 16.19,40.34 47.62,40.34 48.9,41.6 v61.28,41.6 | v61.28,43.51 62.87,45.1 v87.31,45.1
ADDR5  (via drill 0.25)
  Top 0.127: IC27.7 141.29,53.99 v141.29,57.8 | IC41.7 82.87,53.35 82.87,50.49 83.5,49.86 v83.5,37.48 | v106.68,33.67 109.22,31.13 IC17.7 | v15.56,36.52 15.88,36.84 v15.88,39.06 | v74.3,39.38 75.25,38.43 v75.25,37.48 | v124.78,59.07 124.14,58.43 124.14,44.46 124.78,43.83 v124.78,38.75
  Bottom 0.127: IC49.7 169.86,64.15 174.31,64.15 174.31,60.66 171.45,57.8 v141.29,57.8 140.02,59.07 v124.78,59.07 | X1.A8 6.35,34.62 10.48,34.62 12.38,36.52 v15.56,36.52 | v15.88,39.06 16.51,39.7 47.62,39.7 48.26,40.34 65.72,40.34 66.67,39.38 v74.3,39.38 | v75.25,37.48 v83.5,37.48 90.17,37.48 93.98,33.67 v106.68,33.67 119.7,33.67 v124.78,38.75
ADDR6  (via drill 0.25)
  Top 0.127: X1.A9 6.35,37.16 6.35,35.57 7.3,34.62 v11.11,34.62 | v29.53,48.27 v29.53,34.3 | v62.87,49.23 63.18,48.91 v63.18,47.95 | v77.15,51.45 77.47,51.77 IC41.5
  Route15 0.127: IC17.5 97.47,34.94 97.47,37.16 86.04,48.59 86.04,49.23 83.19,52.08 79.06,52.08 IC41.5 | IC49.5 159.07,62.88 153.35,62.88 145.73,55.26 137.48,55.26 IC27.5
  Bottom 0.127: IC27.5 134.3,52.08 79.38,52.08 77.79,53.67 IC41.5 | v11.11,34.62 11.43,34.3 v29.53,34.3 | v29.53,48.27 61.91,48.27 v62.87,49.23 | v63.18,47.95 63.18,48.27 65.72,50.81 76.52,50.81 v77.15,51.45
ADDR7  (via drill 0.25)
  Top 0.127: IC49.3 154.62,63.51 v154.62,57.16 | v131.76,58.43 130.81,57.48 IC27.3 | X1.A10 6.35,42.24 6.35,43.83 7.3,44.78 8.26,44.78 8.26,45.1 8.89,45.73 8.89,46.37 9.84,47.32 11.11,47.32 v11.11,47.64 | v72.07,51.45 72.39,51.77 IC41.3
  Route2 0.127: IC17.3 88.58,38.75 88.58,41.6 83.19,47 80.01,47 78.42,48.59 78.42,49.23 75.56,52.08 73.98,52.08 IC41.3
  Bottom 0.127: IC27.3 129.22,55.26 73.98,55.26 IC41.3 | v154.62,57.16 141.29,57.16 140.02,58.43 v131.76,58.43 | v11.11,47.64 61.91,47.64 65.72,51.45 v72.07,51.45
ADDR8  (via drill 0.25)
  Top 0.127: IC18.18 98.11,24.14 98.11,43.83 97.47,44.46 v97.47,47.64 | v72.07,42.56 72.07,48.27 IC42.18
  Bottom 0.127: IC42.18 73.98,50.18 97.47,50.18 | 97.47,50.18 129.22,50.18 IC28.18 | 97.47,50.18 v97.47,47.64 | IC50.18 155.89,21.6 147,21.6 146.37,20.97 123.19,20.97 122.56,21.6 100.65,21.6 IC18.18 | X1.A11 6.35,42.24 66.36,42.24 66.67,42.56 v72.07,42.56
ADDR9  (via drill 0.25)
  Top 0.127: IC50.16 162.88,23.51 v162.88,26.68 | v137.79,33.67 137.48,33.98 v137.48,44.46
  Route15 0.127: IC18.16 100.01,27.32 100.01,28.9 94.61,34.3 92.71,34.3 86.04,40.97 86.04,41.6 80.64,47 79.06,47 IC42.16
  Bottom 0.127: 134.62,47.32 134.3,47 90.49,47 | 134.62,47.32 IC28.16 | 90.49,47 79.06,47 IC42.16 | v162.88,26.68 168.28,26.68 168.59,27 168.59,30.49 150.5,30.49 149.22,31.76 139.7,31.76 v137.79,33.67 | 134.62,47.32 v137.48,44.46 | X1.A12 6.35,44.78 24.45,44.78 24.77,44.46 30.8,44.46 33.34,47 65.72,47 66.99,45.73 89.22,45.73 90.49,47
ADDR10  (via drill 0.25)
  Top 0.127: IC50.14 167.64,26.05 168.59,27 v168.59,32.4 | IC28.14 141.92,47.64 v141.92,32.4 v141.92,25.41 | v32.07,17.47 v30.16,15.57 | v89.22,24.14 90.49,25.41 v90.49,26.68
  Route2 0.127: IC42.14 88.58,42.56 91.44,42.56 98.11,35.89 98.11,35.25 104.14,29.22 104.78,29.22 105.73,28.27 105.73,27.32 v106.36,26.68 109.22,23.82 IC18.14
  Bottom 0.127: v141.92,32.4 v168.59,32.4 | X1.A13 4.45,47.95 3.81,47.95 2.86,47 2.86,17.16 4.45,17.16 4.76,16.84 17.46,16.84 18.73,15.57 v30.16,15.57 | v32.07,17.47 32.38,17.79 40.64,17.79 41.27,17.16 65.41,17.16 69.22,20.97 86.04,20.97 v89.22,24.14 | v90.49,26.68 v106.36,26.68 113.35,26.68 114.62,25.41 v141.92,25.41
ADDR11  (via drill 0.25)
  Top 0.127: IC42.12 86.68,47.64 v86.68,29.22 86.68,2.23 v86.36,1.92 | IC28.12 145.1,47.64 v145.1,26.05 | X1.A14 2.54,51.13 2.54,19.06 v6.03,15.57 | v32.38,1.92 v29.21,5.09
  Bottom 0.127: 115.89,24.78 IC18.12 | 145.1,24.78 171.13,24.78 IC50.12 | 145.1,24.78 115.89,24.78 | v86.68,29.22 91.12,24.78 115.89,24.78 | 145.1,24.78 v145.1,26.05 | v6.03,15.57 13.65,7.95 21.91,7.95 24.77,5.09 v29.21,5.09 | v32.38,1.92 33.34,0.97 79.06,0.97 79.38,0.65 85.09,0.65 v86.36,1.92
ADDR12  (via drill 0.25)
  Top 0.127: IC42.9 87.95,40.65 87.95,33.03 | v87.95,28.59 87.95,33.03 | v113.35,26.05 113.35,16.52 IC18.9 | v146.05,19.38 IC28.9 | X1.A15 6.35,52.4 6.35,45.73 5.4,44.78 3.81,44.78 3.81,40.65 4.76,39.7 v11.11,39.7 | v30.8,38.43 32.07,37.16 v32.07,32.08 | 87.95,33.03 v87.31,33.03
  Bottom 0.127: IC18.9 115.89,17.16 146.05,17.16 | 146.05,17.16 171.13,17.16 IC50.9 | v87.95,28.59 90.49,26.05 v113.35,26.05 | 146.05,17.16 v146.05,19.38 | v11.11,39.7 12.38,38.43 v30.8,38.43 | v32.07,32.08 33.66,30.49 41.91,30.49 42.55,29.86 60.96,29.86 63.5,32.4 67.94,32.4 69.85,34.3 78.11,34.3 79.38,33.03 v87.31,33.03
ADDR13  (via drill 0.25)
  Top 0.127: v112.08,20.33 109.22,17.47 IC18.7 | v142.56,39.38 142.56,21.6 141.92,20.97 v141.92,20.33 | X1.A16 3.81,57.48 3.81,64.15 4.76,65.1 13.97,65.1 v13.97,40.97 | v48.26,38.75 v46.04,40.97 | v82.23,38.75 82.55,39.06 IC42.7
  Route15 0.127: IC42.7 88.58,34.94 88.58,26.36 v97.79,17.16
  Bottom 0.127: v97.79,17.16 107.63,17.16 IC18.7 | IC50.7 169.23,13.98 173.35,13.98 173.67,14.3 173.67,19.7 146.37,19.7 146.05,20.01 141.92,20.01 | 141.92,20.01 122.87,20.01 122.56,19.7 116.52,19.7 115.89,20.33 v112.08,20.33 | v142.56,39.38 IC28.7 | 141.92,20.01 v141.92,20.33 | v46.04,40.97 v13.97,40.97 | v82.23,38.75 v48.26,38.75
ADDR14  (via drill 0.25)
  Top 0.127: IC18.5 105.73,13.98 107.63,13.98 107.63,20.01 105.73,21.92 105.73,25.09 107.63,27 107.63,32.08 105.73,33.98 v105.73,39.38 | IC50.5 161.61,14.62 161.61,11.12 160.66,10.17 153.99,10.17 153.99,17.47 158.43,21.92 v158.43,38.11
  Route2 0.127: v47.31,55.26 48.58,55.26 51.75,52.08 61.28,52.08 69.53,43.83 74.61,43.83 IC42.5
  Bottom 0.127: IC42.5 79.06,39.38 v105.73,39.38 134.3,39.38 IC28.5 138.75,38.11 v158.43,38.11 | X1.A17 6.35,60.02 25.08,60.02 25.4,59.7 34.29,59.7 35.56,58.43 40.01,58.43 43.18,55.26 v47.31,55.26
ADDR15  (via drill 0.25)
  Top 0.127: X1.A18 6.35,62.56 13.34,62.56 v13.34,42.88 | v72.71,44.46 72.71,41.29 IC42.3 | IC18.3 98.42,16.2 98.42,21.6 97.47,22.55 v97.47,40.02
  Bottom 0.127: IC18.3 100.65,13.98 155.89,13.98 IC50.3 | IC42.3 73.98,42.56 97.47,42.56 | 97.47,42.56 129.22,42.56 IC28.3 | v13.34,42.88 61.28,42.88 62.87,44.46 v72.71,44.46 | 97.47,42.56 v97.47,40.02
ADDR-REG-ID0  (via drill 0.25)
  Top 0.127: IC38.2 15.24,89.23 15.24,40.65 v13.65,39.06
  Route15 0.127: v13.65,39.06 13.65,33.98 12.7,33.03 12.7,25.09 10.79,23.19 X1.C3
ADDR-REG-ID1  (via drill 0.25)
  Top 0.127: IC38.3 16.19,85.1 16.19,53.67 16.51,53.35 v16.51,26.36
  Bottom 0.127: v16.51,26.36 15.88,25.73 X1.C4
ADDR-REG-ID2  (via drill 0.25)
  Top 0.127: IC38.14 28.26,83.83 v28.26,31.13 | v12.06,29.86 10.48,28.27 X1.C5
  Bottom 0.127: v28.26,31.13 28.26,29.86 v12.06,29.86
ADDR-REG-ID3  (via drill 0.25)
  Top 0.127: v32.07,45.1 v32.07,81.29 | v12.7,43.51 12.06,42.88 12.06,32.71 X1.C6
  Bottom 0.127: IC38.13 28.26,81.29 v32.07,81.29 | v32.07,45.1 30.48,43.51 v12.7,43.51
BUS-DIR  (via drill 0.25)
  Top 0.127: 34.61,74.31 34.61,68.91 35.56,67.96 IC37.1 35.56,58.11 v35.88,57.8 | IC36.1 34.61,74.31 | IC35.1 34.61,87.01 34.61,74.31 | v46.04,13.98 42.23,17.79 42.23,38.75 41.59,39.38 v41.59,55.26
  Bottom 0.127: IC34.4 48.58,13.98 v46.04,13.98 | v41.59,55.26 39.05,57.8 v35.88,57.8
DATA0
  Top 0.127: IC37.2 37.15,63.51 37.15,87.01 IC35.2
  Bottom 0.127: X1.A19 6.35,65.1 35.56,65.1 IC37.2
DATA1
  Top 0.127: IC37.3 40.32,62.88 40.32,68.27 39.69,68.91 39.69,87.01 IC35.3
  Bottom 0.127: X1.A20 6.35,67.64 22.23,67.64 24.13,65.73 37.47,65.73 IC37.3
DATA2  (via drill 0.25)
  Top 0.127: IC37.4 42.23,63.51 42.23,87.01 IC35.4 | X1.A21 3.81,70.18 3.81,87.01 4.76,87.96 11.11,87.96 v11.11,88.28
  Bottom 0.127: v11.11,88.28 33.66,88.28 34.92,89.55 41.59,89.55 IC35.4
DATA3  (via drill 0.25)
  Top 0.127: IC37.5 44.77,63.51 44.77,68.59 | 44.77,68.59 44.77,87.01 IC35.5 | 44.77,68.59 v42.86,68.59
  Bottom 0.127: X1.A22 6.35,72.72 13.65,72.72 15.56,70.81 32.7,70.81 34.92,68.59 v42.86,68.59
DATA4  (via drill 0.25)
  Top 0.127: IC37.6 47.31,63.51 47.31,72.4 | 47.31,72.4 47.31,87.01 IC35.6 | 47.31,72.4 v46.35,72.4
  Bottom 0.127: X1.A23 6.35,75.26 12.38,75.26 15.24,72.4 v46.35,72.4
DATA5  (via drill 0.25)
  Top 0.127: IC37.7 49.85,63.51 49.85,87.01 IC35.7 | X1.A24 6.35,77.8 11.43,77.8 v11.43,83.2
  Bottom 0.127: v11.43,83.2 13.34,85.1 47.94,85.1 IC35.7
DATA6  (via drill 0.25)
  Top 0.127: IC37.8 52.39,63.51 v52.39,78.12 52.39,87.01 IC35.8
  Bottom 0.127: X1.A25 6.35,80.34 18.41,80.34 18.73,80.02 22.23,80.02 24.13,78.12 v52.39,78.12
DATA7
  Top 0.127: IC37.9 55.56,62.88 55.56,68.27 54.93,68.91 54.93,87.01 IC35.9
  Bottom 0.127: X1.A26 3.81,82.88 3.81,90.5 10.79,90.5 11.11,90.18 45.4,90.18 46.04,89.55 54.29,89.55 IC35.9
DATA8  (via drill 0.25)
  Top 0.127: IC36.2 37.78,75.58 v37.78,80.66
  Bottom 0.127: v37.78,80.66 24.13,80.66 22.23,82.56 10.79,82.56 10.48,82.88 6.35,82.88 X1.A27
DATA9  (via drill 0.25)
  Top 0.127: v29.53,73.67 28.89,74.31 28.89,85.42 26.67,87.64 v24.13,87.64
  Bottom 0.127: IC36.3 39.05,73.67 v29.53,73.67 | v24.13,87.64 22.23,85.74 10.79,85.74 10.48,85.42 6.35,85.42 X1.A28
DATA10  (via drill 0.25)
  Top 0.127: v21.91,73.04 21.59,73.36 v21.59,86.37
  Bottom 0.127: IC36.4 40.96,73.04 v21.91,73.04 | v21.59,86.37 20.32,87.64 10.79,87.64 10.48,87.96 6.35,87.96 X1.A29
DATA11  (via drill 0.25)
  Top 0.127: v23.81,71.77 22.23,73.36 v22.23,91.45
  Bottom 0.127: IC36.5 45.72,73.04 46.35,73.04 46.99,72.4 46.99,71.77 v23.81,71.77 | v22.23,91.45 20.64,93.04 6.35,93.04 X1.A30
DATA12  (via drill 0.25)
  Top 0.127: v34.92,64.15 34.61,63.83 34.61,60.02 33.97,59.38 v33.97,21.6
  Route2 0.127: IC36.6 44.13,71.13 44.13,68.91 39.37,64.15 v34.92,64.15
  Bottom 0.127: v33.97,21.6 33.34,20.97 28.57,20.97 27.94,21.6 10.79,21.6 10.48,21.92 8.89,21.92 X1.B3
DATA13  (via drill 0.25)
  Top 0.127: IC36.7 50.48,75.58 v50.48,78.75 | v32.7,78.75 32.7,27.63 v29.53,24.46 | v11.11,24.14 10.79,24.14 10.48,24.46 8.89,24.46 X1.B4
  Bottom 0.127: v32.7,78.75 v50.48,78.75 | v29.53,24.46 29.21,24.14 v11.11,24.14
DATA14  (via drill 0.25)
  Top 0.127: v51.75,73.36 51.75,60.66 49.21,58.11 49.21,56.21 v47.31,54.3 | v35.56,51.45 35.24,51.13 v35.24,33.03 | v12.06,31.13 10.48,29.54 7.62,29.54 X1.B5
  Bottom 0.127: IC36.8 53.34,73.36 v51.75,73.36 | v47.31,54.3 44.45,51.45 v35.56,51.45 | v35.24,33.03 34.92,32.71 28.26,32.71 27.3,31.76 12.7,31.76 v12.06,31.13
DATA15  (via drill 0.25)
  Top 0.127: v49.21,71.77 49.21,60.66 46.67,58.11 v46.67,54.62 | v38.42,53.99 38.1,53.67 v38.1,25.09
  Bottom 0.127: IC36.9 52.39,71.77 v49.21,71.77 | v46.67,54.62 46.04,53.99 v38.42,53.99 | v38.1,25.09 28.26,25.09 27.94,24.78 10.79,24.78 10.48,24.46 4.76,24.46 3.81,25.41 3.81,29.54 6.35,29.54 X1.B6
GND
  pour Route15: 0,105.74 0,114.63 176.53,114.63 176.53,0.33 0,0.33 0,9.22 6.35,9.22 6.35,16.84 0,16.84 0,98.12 6.35,98.12 6.35,105.74
N$1  (via drill 0.25)
  Top 0.127: IC36.19 39.05,83.83 39.05,94.63 IC35.19 | IC31.8 57.47,33.03 v57.47,73.36
  Route2 0.127: v57.47,73.36 57.47,75.58 51.75,81.29 39.69,81.29 IC36.19
N$2
  Top 0.127: IC10.4 105.73,92.72 105.73,111.14 IC9.13
N$3
  Top 0.127: IC10.5 109.22,97.17 108.27,98.12 108.27,111.14 IC9.12
N$4
  Route2 0.127: IC11.4 100.65,59.7 100.65,81.61 105.73,86.69 105.73,98.44 IC10.13
N$5
  Top 0.127: IC11.5 109.22,58.11 110.17,59.07 110.17,98.12 109.22,99.07 IC10.12
N$6
  Top 0.127: IC12.4 105.73,41.92 105.73,60.34 IC11.13
N$7
  Top 0.127: IC12.5 108.27,41.92 108.27,57.8 109.22,58.75 IC11.12
N$8  (via drill 0.25)
  Top 0.127: IC9.11 110.81,111.14 110.81,100.34 IC10.11 115.25,95.9 115.25,90.5 113.35,88.59 113.35,70.18 115.25,68.27 v115.25,57.16 | IC15.8 120.02,13.67 v120.02,37.48
  Route2 0.127: v120.02,37.48 119.7,37.8 119.7,52.72 v115.25,57.16
N$9  (via drill 0.25)
  Top 0.127: IC15.3 108.27,4.46 113.35,4.46 113.35,1.6 113.67,1.28 121.6,1.28 121.6,16.2 122.87,17.47 122.87,36.21 120.97,38.11 120.97,63.51 121.6,64.15 121.6,67 v120.97,67.64 | v113.03,91.14 112.71,91.45 112.71,96.22 110.17,98.75 110.17,103.52 IC9.5
  Route2 0.127: v120.97,67.64 118.43,70.18 118.43,80.97 113.35,86.05 113.35,90.82 v113.03,91.14
N$10
  Top 0.127: IC4.4 74.61,66.69 74.61,72.08 73.98,72.72 73.98,85.74 IC3.13
N$11
  Top 0.127: IC4.5 77.15,66.69 77.15,72.08 76.52,72.72 76.52,85.74 IC3.12
N$12
  Top 0.127: IC5.4 75.25,28.59 75.25,33.98 75.88,34.62 75.88,72.08 74.93,73.04 IC4.13
N$13
  Top 0.127: IC5.5 78.42,29.22 78.42,73.04 IC4.12
N$14
  Top 0.127: IC6.4 73.98,16.52 73.98,34.94 IC5.13
N$15
  Top 0.127: IC6.5 76.52,16.52 76.52,33.98 77.47,34.94 IC5.12
N$16  (via drill 0.25)
  Top 0.127: IC1.8 92.39,10.81 v92.39,55.89 | v77.79,56.53 76.52,57.8 76.52,72.08 v76.2,72.4 75.88,72.72 75.88,80.34 75.25,80.97 v75.25,85.1
  Bottom 0.127: v92.39,55.89 91.76,56.53 v77.79,56.53 | v76.2,72.4 78.11,72.4 79.69,73.99 IC4.11 | IC3.11 78.42,85.1 v75.25,85.1
N$17  (via drill 0.25)
  Top 0.127: IC1.3 86.04,6.36 v86.04,32.4 | v69.85,33.67 70.8,34.62 v70.8,64.78
  Route2 0.127: v70.8,64.78 70.8,68.27 76.52,73.99 76.52,78.12 IC3.5
  Bottom 0.127: v86.04,32.4 71.12,32.4 v69.85,33.67
N$18  (via drill 0.25)
  Top 0.127: IC1.6 90.17,8.27 91.12,9.22 91.12,15.57 88.58,18.11 v88.58,35.89
  Route15 0.127: v88.58,35.89 83.5,40.97 83.5,41.6 78.11,47 74.93,47 73.98,47.95 73.98,78.12 IC3.4
N$19
  Route15 0.127: IC31.3 28.26,44.46 26.35,44.46 21.27,49.54 21.27,61.61 IC32.1
N$20
  Top 0.127: IC7.19 68.26,110.5 68.26,105.42 IC7.1
  Bottom 0.127: IC2.3 49.85,99.07 53.98,99.07 54.93,100.02 54.93,104.47 IC7.1
N$21  (via drill 0.25)
  Top 0.127: IC8.19 69.85,102.25 v66.36,102.25 66.36,92.72 IC8.1
  Bottom 0.127: IC2.6 57.47,102.25 v66.36,102.25
N$22  (via drill 0.25)
  Top 0.127: IC1.11 82.23,13.35 79.06,13.35 79.06,22.24 | IC6.11 79.06,22.24 | v79.38,33.67 79.06,33.35 79.06,22.24
  Bottom 0.127: IC5.11 80.01,33.67 v79.38,33.67
N$23  (via drill 0.25)
  Top 0.127: IC15.6 120.97,9.54 120.97,37.16 120.33,37.8 120.33,63.51 120.97,64.15 v120.97,67 | v122.24,67.64 122.87,68.27 122.87,72.4 122.24,73.04 122.24,80.34 122.87,80.97 v122.87,101.61 | v107,101.61 106.68,101.93 IC9.4
  Bottom 0.127: v120.97,67 121.6,67.64 v122.24,67.64 | v107,101.61 v122.87,101.61
N$24  (via drill 0.25)
  Top 0.127: IC31.6 55.56,24.78 v55.56,28.59 | v41.59,29.22 40.96,29.86 40.96,36.52 40.32,37.16 v40.32,60.34
  Bottom 0.127: v55.56,28.59 54.93,29.22 v41.59,29.22 | v40.32,60.34 39.69,60.97 26.99,60.97 IC32.15
N$25  (via drill 0.25)
  Top 0.127: IC2.8 58.74,107.96 v58.74,103.83 | v94.3,101.61 96.52,99.39 IC13.19 | IC13.1 93.03,80.02 v93.03,101.61